# Altium project P22296-1.PrjPcb (part 1 of 3)
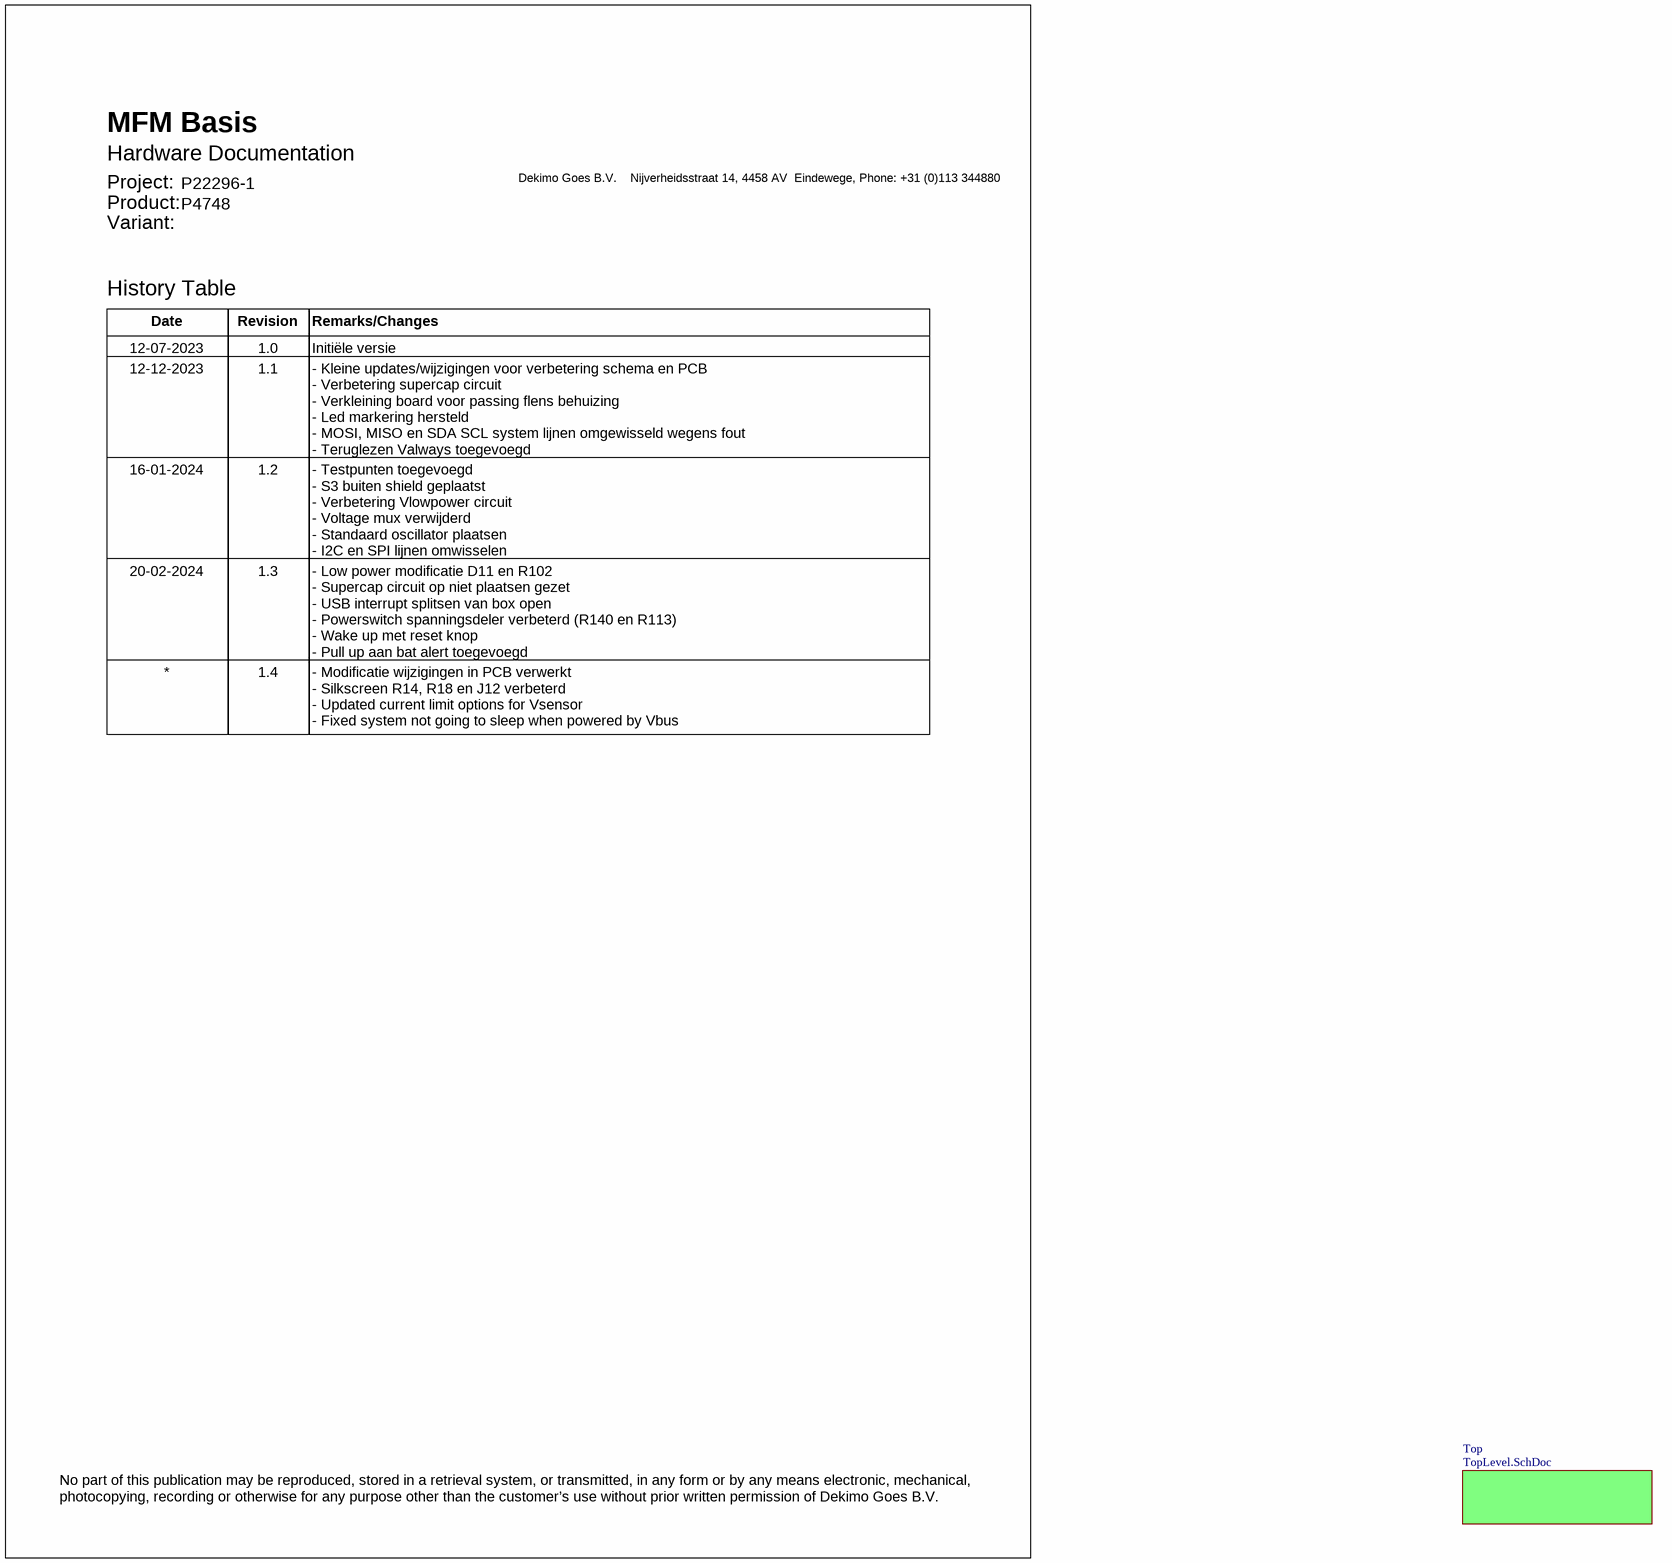
[diagram p0: Revison Table.SchDoc]
DCISheetTotal: 13; Designer: HMK; Drawingnumber: P22296-1-DES-1; PCBRev: 1.2; ProductNumber: P4748; Project: MFM Basis; ProjectNumber: P22296; ProjectRev: 1.4; VolgNumber: 1
14 sheets, 449 parts. Net scope: hierarchical (ports join the sheet entries above them; power ports are global).
Board file: P22296-1-DES-1.2.PcbDoc
Sheets:
  Revison Table.SchDoc
    Top = TopLevel.SchDoc
      U_MCU = MCU.SchDoc
        MCU_RF = MCU_RF.SchDoc
      U_Sensor = Sensor.SchDoc
        SensorSlot1 = SensorSlot1.SchDoc
        SensorSlot2 = SensorSlot2.SchDoc
      U_BatteryMonitor = BatteryMonitor.SchDoc
      U_Mechanical = Mechanical.SchDoc
      U_Memory = Memory.SchDoc
      U_RTC = RTC.SchDoc
      U_USB = USB.SchDoc
      U_Power1 = Power1.SchDoc
      U_Power2 = Power2.SchDoc

## Sheet Revison Table.SchDoc: Titel
size A4 portrait; ApprovedBy: name; CompanyName: DCI Electronics bv; DrawnBy: KRS; Address1: Nijverheidsstraat 14; Address2: 4458 AV Eindewege; Address3: Phone: +31 (0)113 344880; DocumentNumber: 1; Revision: 1; SheetNumber: 1; SheetTotal: 14; PageSetup: Record=PageOptions|CenterHorizontal=True|CenterVertical=True|PrintScale=1.00|XCorrection=1.00|YCorrection=1.00|PrintKind=1|BorderSize=5000000|LeftOffset=0|BottomOffset=0|Orientation=2|PaperLength=1000|PaperWidth=1000|Scale=100|PaperSource=7|PrintQuality=-4|MediaType=1|DitherType=10|PaperKind=ISO_A4_(210.00_x_297.00_MM)|PrintScaleMode=1; SubTitle: SubTitel; ApprovedDate: 01-01-12; DesignedBy: HMK

### Sub-sheets
Top = TopLevel.SchDoc: no entries

### Notes on the sheet
- 12-07-2023
- 1.0
- Initiële versie
- 12-12-2023
- 1.1
- - Kleine updates/wijzigingen voor verbetering schema en PCB
  - Verbetering supercap circuit
  - Verkleining board voor passing flens behuizing
  - Led markering hersteld
  - MOSI, MISO en SDA SCL system lijnen omgewisseld wegens fout
  - Teruglezen Valways toegevoegd
- 16-01-2024
- 1.2
- - Testpunten toegevoegd
  - S3 buiten shield geplaatst
  - Verbetering Vlowpower circuit
  - Voltage mux verwijderd
  - Standaard oscillator plaatsen
  - I2C en SPI lijnen omwisselen
- 20-02-2024
- 1.3
- - Low power modificatie D11 en R102
  - Supercap circuit op niet plaatsen gezet
  - USB interrupt splitsen van box open
  - Powerswitch spanningsdeler verbeterd (R140 en R113)
  - Wake up met reset knop
  - Pull up aan bat alert toegevoegd
- 1.4
- - Modificatie wijzigingen in PCB verwerkt
  - Silkscreen R14, R18 en J12 verbeterd
  - Updated current limit options for Vsensor
  - Fixed system not going to sleep when powered by Vbus
- Hardware Documentation
- Project:
- Product:
- Variant:
- Dekimo Goes B.V.
- Nijverheidsstraat 14, 4458 AV  Eindewege, Phone: +31 (0)113 344880
- History Table
- Date
- Revision
- Remarks/Changes
- No part of this publication may be reproduced, stored in a retrieval system, or transmitted, in any form or by any means electronic, mechanical, photocopying, recording or otherwise for any purpose other than the customer’s use without prior written permission of Dekimo Goes B.V.

## Sheet TopLevel.SchDoc: Titel
size A3; ApprovedBy: name; CompanyName: DCI Electronics bv; DrawnBy: KRS; Address1: Nijverheidsstraat 14; Address2: 4458 AV Eindewege; Address3: Phone: +31 (0)113 344880; DocumentNumber: 2; Revision: 1; SheetNumber: 2; SheetTotal: 14; PageSetup: Record=PageOptions|CenterHorizontal=True|CenterVertical=True|PrintScale=1.00|XCorrection=1.00|YCorrection=1.00|PrintKind=1|BorderSize=5000000|LeftOffset=0|BottomOffset=0|Orientation=2|PaperLength=1000|PaperWidth=1000|Scale=100|PaperSource=7|PrintQuality=-4|MediaType=1|DitherType=10|PaperKind=ISO_A4_(210.00_x_297.00_MM)|PrintScaleMode=1; SubTitle: SubTitel; ApprovedDate: 01-01-12; DesignedBy: HMK
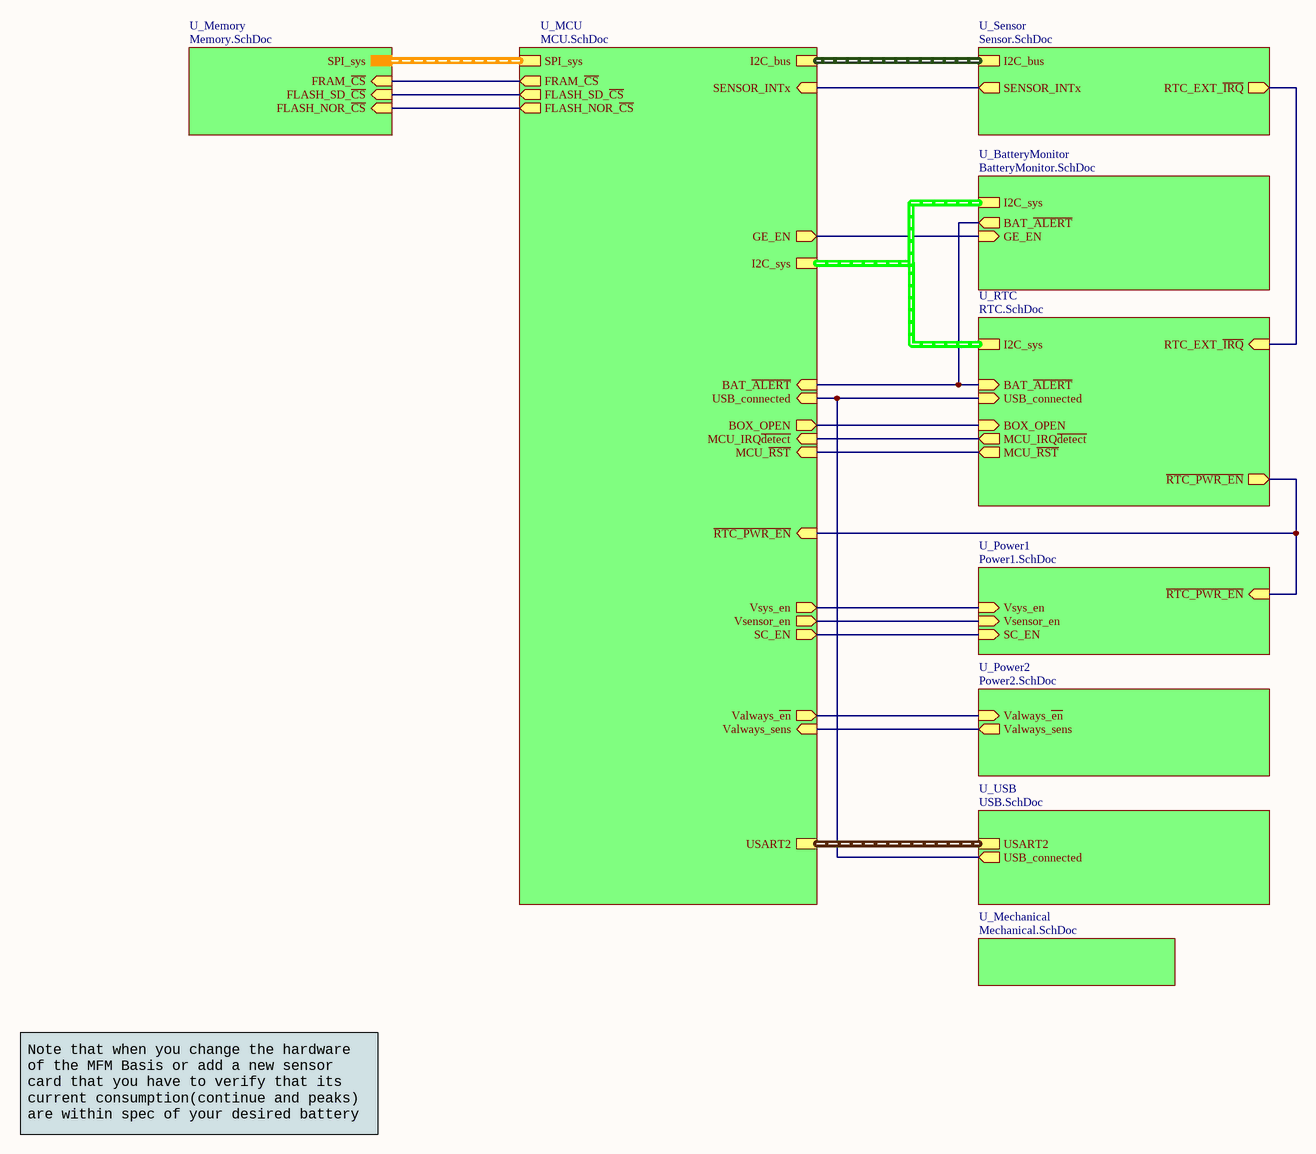
[diagram p1: TopLevel.SchDoc]

### Sub-sheets
U_BatteryMonitor = BatteryMonitor.SchDoc: BAT_~{ALERT} (out), I2C_sys (harness I2C), GE_EN (in)
U_MCU = MCU.SchDoc: MCU_~{RST} (in), SPI_sys (harness SPI), I2C_sys (harness I2C), I2C_bus (harness I2C), USART2 (harness UART), Vsensor_en (out), Vsys_en (out), FRAM_~{CS} (out), FLASH_SD_~{CS} (out), FLASH_NOR_~{CS} (out), MCU_IRQ~{detect} (in), USB_connected (in), SENSOR_INTx (in), Valways_~{en} (out), BAT_~{ALERT} (in), ~{RTC_PWR_EN} (in), SC_EN (out), GE_EN (out), Valways_sens (in), BOX_OPEN (out)
U_Mechanical = Mechanical.SchDoc: no entries
U_Memory = Memory.SchDoc: SPI_sys (harness SPI), FRAM_~{CS} (in), FLASH_SD_~{CS} (in), FLASH_NOR_~{CS} (in)
U_Power1 = Power1.SchDoc: Vsys_en (in), Vsensor_en (in), ~{RTC_PWR_EN} (in), SC_EN (in)
U_Power2 = Power2.SchDoc: Valways_~{en} (in), Valways_sens (out)
U_RTC = RTC.SchDoc: I2C_sys (harness I2C), ~{RTC_PWR_EN} (out), MCU_~{RST} (out), MCU_IRQ~{detect} (out), USB_connected (in), BAT_~{ALERT} (in), BOX_OPEN (in), RTC_EXT_~{IRQ} (in)
U_Sensor = Sensor.SchDoc: I2C_bus (harness I2C), RTC_EXT_~{IRQ} (out), SENSOR_INTx (out)
U_USB = USB.SchDoc: USB_connected (out), USART2 (harness UART)

### Nets
~{RTC_PWR_EN}: sheet U_MCU/~{RTC_PWR_EN}, sheet U_RTC/~{RTC_PWR_EN}, sheet U_Power1/~{RTC_PWR_EN}
BAT_~{ALERT}: sheet U_MCU/BAT_~{ALERT}, sheet U_BatteryMonitor/BAT_~{ALERT}, sheet U_RTC/BAT_~{ALERT}
BOX_OPEN: sheet U_MCU/BOX_OPEN, sheet U_RTC/BOX_OPEN
FLASH_NOR_~{CS}: sheet U_MCU/FLASH_NOR_~{CS}, sheet U_Memory/FLASH_NOR_~{CS}
FLASH_SD_~{CS}: sheet U_MCU/FLASH_SD_~{CS}, sheet U_Memory/FLASH_SD_~{CS}
FRAM_~{CS}: sheet U_MCU/FRAM_~{CS}, sheet U_Memory/FRAM_~{CS}
GE_EN: sheet U_MCU/GE_EN, sheet U_BatteryMonitor/GE_EN
MCU_IRQ~{detect}: sheet U_MCU/MCU_IRQ~{detect}, sheet U_RTC/MCU_IRQ~{detect}
MCU_~{RST}: sheet U_MCU/MCU_~{RST}, sheet U_RTC/MCU_~{RST}
RTC_EXT_~{IRQ}: sheet U_Sensor/RTC_EXT_~{IRQ}, sheet U_RTC/RTC_EXT_~{IRQ}
SC_EN: sheet U_MCU/SC_EN, sheet U_Power1/SC_EN
SENSOR_INTx: sheet U_MCU/SENSOR_INTx, sheet U_Sensor/SENSOR_INTx
USB_connected: sheet U_MCU/USB_connected, sheet U_RTC/USB_connected, sheet U_USB/USB_connected
Valways_~{en}: sheet U_MCU/Valways_~{en}, sheet U_Power2/Valways_~{en}
Valways_sens: sheet U_MCU/Valways_sens, sheet U_Power2/Valways_sens
Vsensor_en: sheet U_MCU/Vsensor_en, sheet U_Power1/Vsensor_en
Vsys_en: sheet U_MCU/Vsys_en, sheet U_Power1/Vsys_en

### Buses and harness runs
harness sheet U_BatteryMonitor/I2C_sys = sheet U_MCU/I2C_sys = sheet U_RTC/I2C_sys
harness sheet U_MCU/I2C_bus = sheet U_Sensor/I2C_bus
harness sheet U_MCU/SPI_sys = sheet U_Memory/SPI_sys
harness sheet U_MCU/USART2 = sheet U_USB/USART2

### Notes on the sheet
- Note that when you change the hardware of the MFM Basis or add a new sensor card that you have to verify that its current consumption(continue and peaks) are within spec of your desired battery
- Designed by:
- Drawing number:
- Variant:
- Date:
- Page:
- Rev:
- Of:
- Dekimo Goes B.V.
- Nijverheidsstraat 14, 4458 AV  Eindewege, Phone: +31 (0)113 344880

## Sheet MCU.SchDoc: Titel
size A3; ApprovedBy: name; CompanyName: DCI Electronics bv; DrawnBy: KRS; Address1: Nijverheidsstraat 14; Address2: 4458 AV Eindewege; Address3: Phone: +31 (0)113 344880; DocumentNumber: 4; Revision: 2; SheetNumber: 4; SheetTotal: 14; PageSetup: Record=PageOptions|CenterHorizontal=True|CenterVertical=True|PrintScale=1.00|XCorrection=1.00|YCorrection=1.00|PrintKind=1|BorderSize=5000000|LeftOffset=0|BottomOffset=0|Orientation=2|PaperLength=1000|PaperWidth=1000|Scale=100|PaperSource=7|PrintQuality=-4|MediaType=1|DitherType=10|PaperKind=ISO_A4_(210.00_x_297.00_MM)|PrintScaleMode=1; SubTitle: SubTitel; ApprovedDate: 01-01-12; DesignedBy: HMK
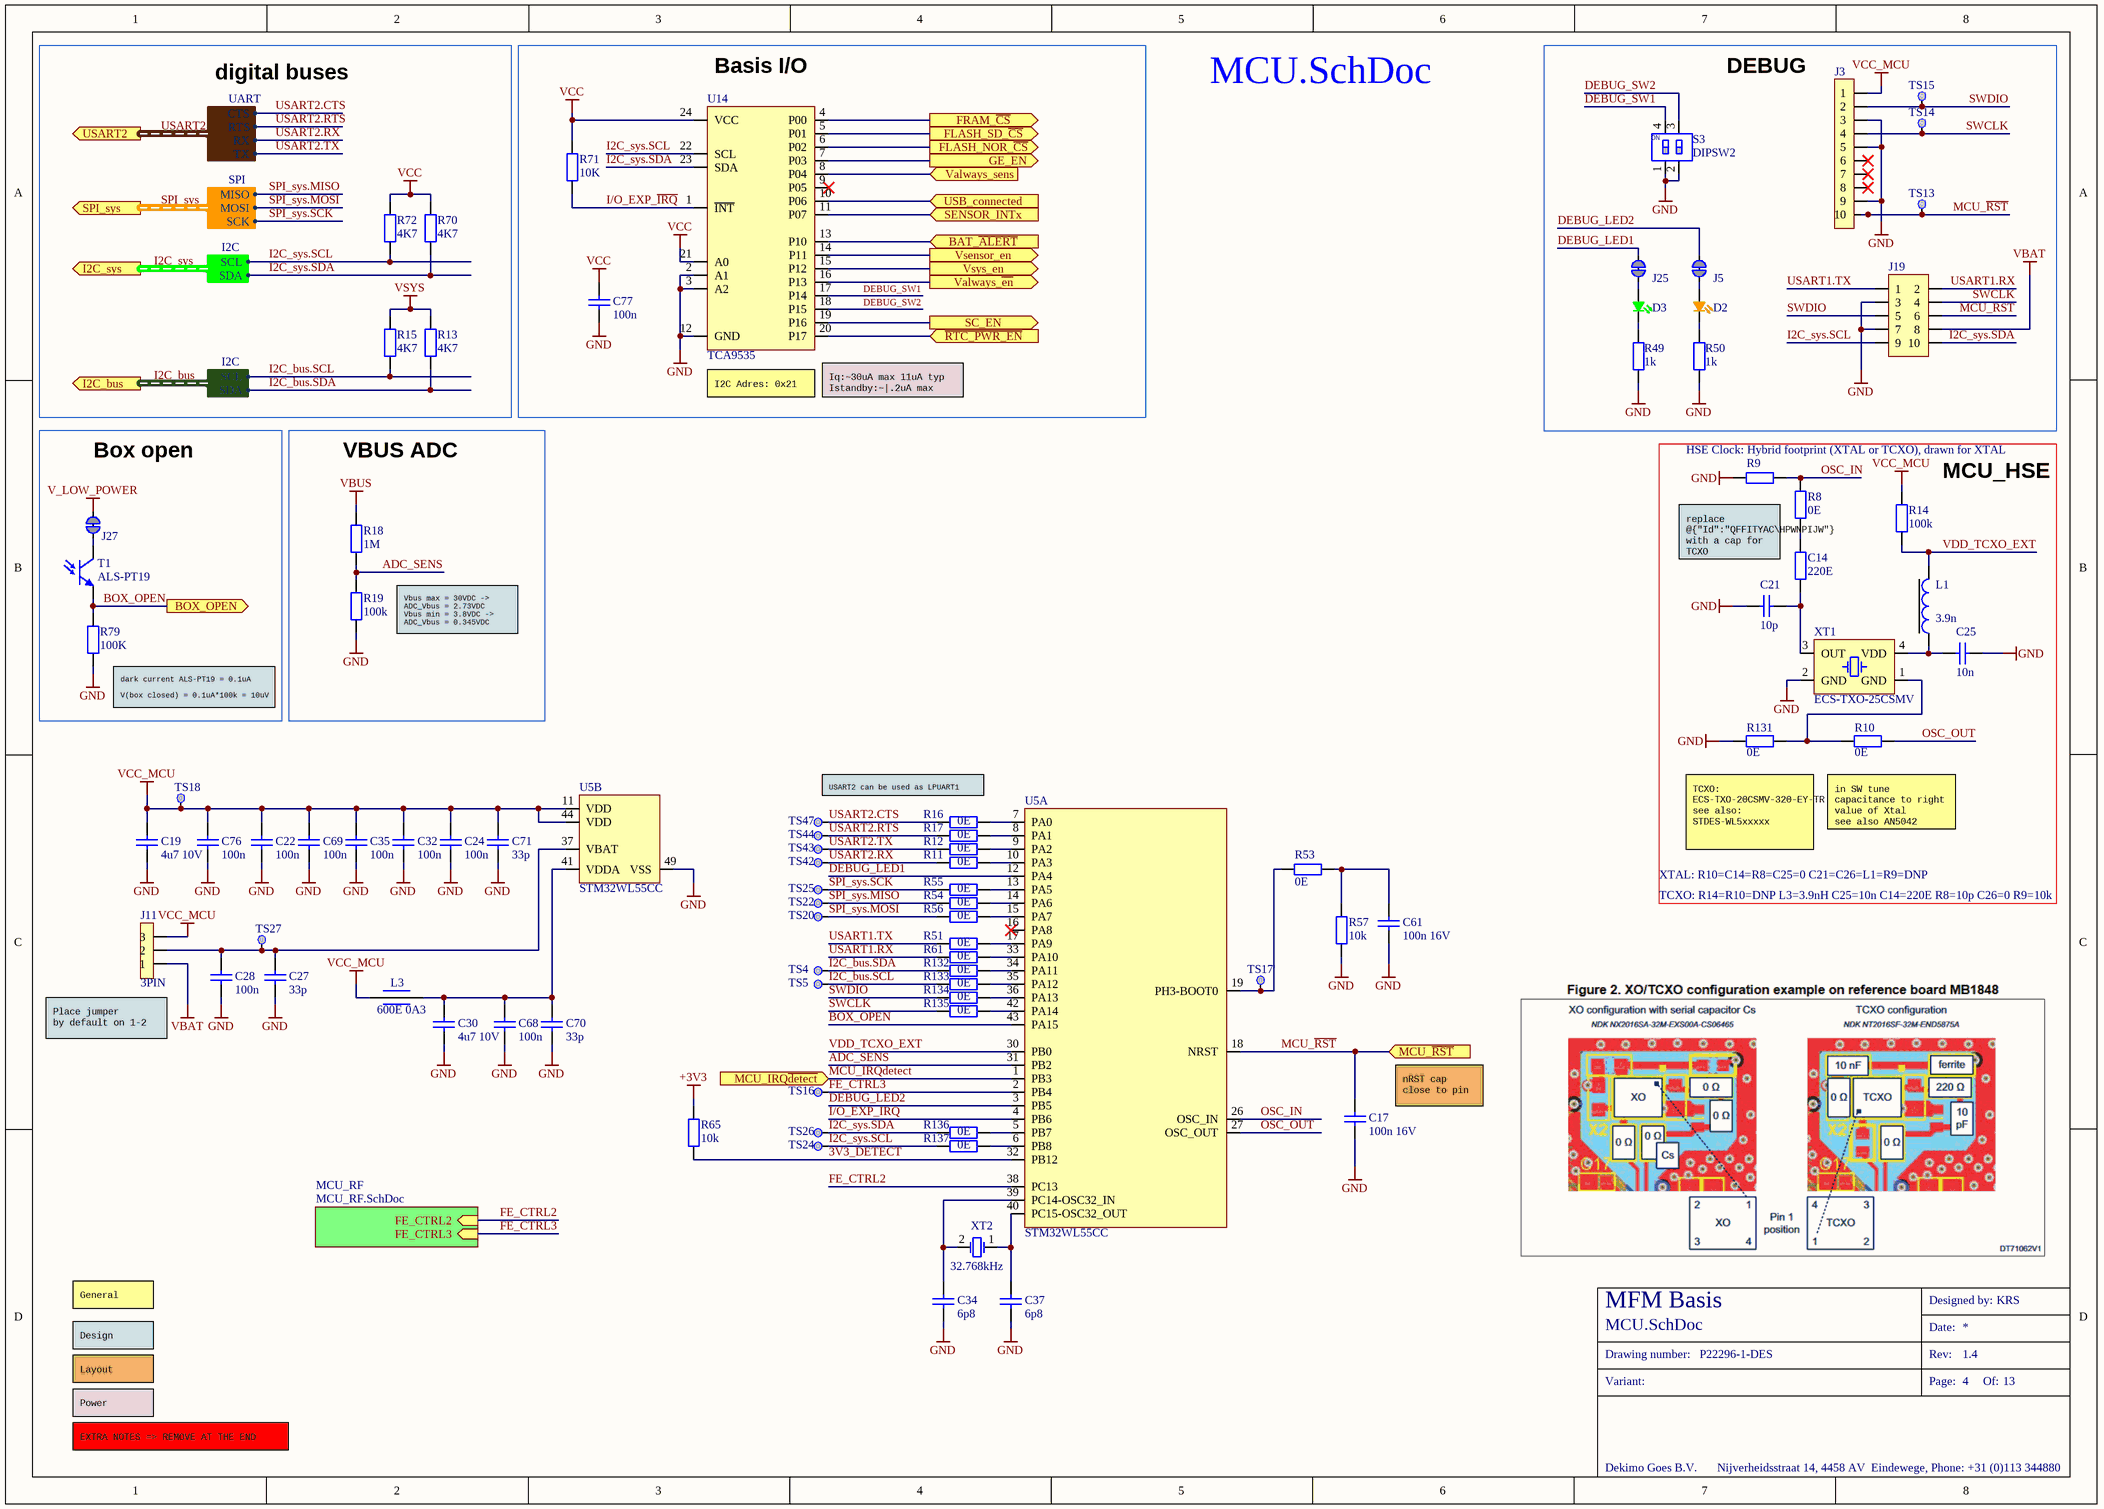
[diagram p2: MCU.SchDoc]

### Parts
C14  220E  [RESC1005X04N]
C17  100n 16V  [CAPC1005X05N]
C19  4u7 10V  [CAPC1608X09N]
C21  10p  [CAPC1005X05N]
C22  100n  [CAPC1005X05N]
C24  100n  [CAP-000G001-002]
C25  10n  [CAP-000G001-002]
C27  33p  [CAP-000G001-002]
C28  100n  [CAP-000G001-002]
C30  4u7 10V  [CAPC1608X09N]
C32  100n  [CAPC1005X05N]
C34  6p8  [CAPC1608X09N]
C35  100n  [CAPC1005X05N]
C37  6p8  [CAPC1608X09N]
C61  100n 16V  [CAPC1005X05N]
C68  100n  [CAPC1005X05N]
C69  100n  [CAPC1005X05N]
C70  33p  [CAP-000G001-002]
C71  33p  [CAPC1005X05N]
C76  100n  [CAPC1005X05N]
C77  100n  [CAPC1608X09N]
D2  (no value)  [LED_0603]
D3  (no value)  [LED_0603_ANODE]
J3  Harwin Archer M50 Series  [PHDR2X5_SMD_P1.27]  (value not drawn)
J5  (no value)  [Solderbridge NC]  (net tie, no BOM)
J11  3PIN  [CON-003G001-003]
J19  (no value)  [PHDR2X5_P2.54]
J25  (no value)  [Solderbridge NC]  (net tie, no BOM)
J27  (no value)  [Solderbridge NC]  (net tie, no BOM)
L1  3.9n  [IND-002G000-002]
L3  600E 0A3  [INDC1608X10N]
R8  0E  [RESC1005X04N]
R9  100E  [RESC1005X04N]  (value not drawn)
R10  0E  [RESC1005X04N]
R11  0E  [RESC1005X04N]
R12  0E  [RESC1005X04N]
R13  4K7  [RESC1005x04N]
R14  100k  [RESC1005X04N]
R15  4K7  [RESC1005x04N]
R16  0E  [RESC1005X04N]
R17  0E  [RESC1005X04N]
R18  1M  [RESC1005x04N]
R19  100k  [RESC1005X04N]
R49  1k  [RESC1608X13N]
R50  1k  [RESC1608X13N]
R51  0E  [RESC1005X04N]
R53  0E  [RESC1005X04N]
R54  0E  [RESC1005X04N]
R55  0E  [RESC1005X04N]
R56  0E  [RESC1005X04N]
R57  10k  [RESC1005X04N]
R61  0E  [RESC1005X04N]
R65  10k  [RESC1005X04N]
R70  4K7  [RESC1005x04N]
R71  10K  [RESC1608X13N]
R72  4K7  [RESC1005x04N]
R79  100K  [RESC1608X13N]
R131  0E  [RESC1005X04N]
R132  0E  [RESC1005X04N]
R133  0E  [RESC1005X04N]
R134  0E  [RESC1005X04N]
R135  0E  [RESC1005X04N]
R136  0E  [RESC1005X04N]
R137  0E  [RESC1005X04N]
S3  DIPSW2  [SW_GDH02S04]
T1  ALS-PT19  [SMD-000G001-002]
TS4  TESTPAD  [TESTPAD 2MM]  (value not drawn)  (no BOM)
TS5  TESTPAD  [TESTPAD 2MM]  (value not drawn)  (no BOM)
TS13  TESTPAD  [TESTPAD 2MM]  (value not drawn)  (no BOM)
TS14  TESTPAD  [TESTPAD 2MM]  (value not drawn)  (no BOM)
TS15  TESTPAD  [TESTPAD 2MM]  (value not drawn)  (no BOM)
TS16  TESTPAD  [TESTPAD 2MM]  (value not drawn)  (no BOM)
TS17  TESTPAD  [TESTPAD 2MM]  (value not drawn)  (no BOM)
TS18  TESTPAD  [TESTPAD 2MM]  (value not drawn)  (no BOM)
TS20  TESTPAD  [TESTPAD 2MM]  (value not drawn)  (no BOM)
TS22  TESTPAD  [TESTPAD 2MM]  (value not drawn)  (no BOM)
TS24  TESTPAD  [TESTPAD 2MM]  (value not drawn)  (no BOM)
TS25  TESTPAD  [TESTPAD 2MM]  (value not drawn)  (no BOM)
TS26  TESTPAD  [TESTPAD 2MM]  (value not drawn)  (no BOM)
TS27  TESTPAD  [TESTPAD 2MM]  (value not drawn)  (no BOM)
TS42  TESTPAD  [TESTPAD 2MM]  (value not drawn)  (no BOM)
TS43  TESTPAD  [TESTPAD 2MM]  (value not drawn)  (no BOM)
TS44  TESTPAD  [TESTPAD 2MM]  (value not drawn)  (no BOM)
TS47  TESTPAD  [TESTPAD 2MM]  (value not drawn)  (no BOM)
U5  STM32WL55CC  [QFN-500G000-048]  (parts A,B of 4)
U14  TCA9535  [SOP-650001-024]
XT1  ECS-TXO-25CSMV  [XTL-001G001-004]
XT2  32.768kHz  [CHIP2PINSM127P600-8N]

### Blocks framed on the sheet
digital buses: R13 R15 R70 R72
Basis I/O: C77 R71 U14
DEBUG: D2 D3 J3 J5 J19 J25 R49 R50 S3 TS13-TS15
Box open: J27 R79 T1
VBUS ADC: R18 R19
MCU_HSE: C14 C21 C25 L1 R8-R10 R14 R131 XT1

### Sub-sheets
MCU_RF = MCU_RF.SchDoc: FE_CTRL2 (in), FE_CTRL3 (in)

### Ports
BAT_~{ALERT} (in), BOX_OPEN (out), FLASH_NOR_~{CS} (out), FLASH_SD_~{CS} (out), FRAM_~{CS} (out), GE_EN (out), I2C_bus (out, harness I2C), I2C_sys (out, harness I2C), MCU_IRQ~{detect} (in), MCU_~{RST} (in), SC_EN (out), SENSOR_INTx (in), SPI_sys (out, harness SPI), USART2 (out, harness UART), USB_connected (in), Valways_sens (in), Valways_~{en} (out), Vsensor_en (out), Vsys_en (out), ~{RTC_PWR_EN} (in)

### Harnesses
SPI: MISO, MOSI, SCK
I2C: SCL, SDA
UART: CTS, RTS, RX, TX

### Nets
+3V3: R65.2
GND: C17.1 C19.1 C21.1 C22.1 C24.1 C25.1 C27.1 C28.1 C30.1 C32.1 C34.1 C35.1 C37.1 C61.1 C68.1 C69.1 C70.1 C71.1 C76.1 C77.1 J3.3 J3.5 J3.9 J19.3 J19.7 R9.1 R19.1 R49.1 R50.1 R57.1 R79.1 R131.1 S3.1(A1) S3.2(A2) U5.49(VSS) U14.2(A1) U14.3(A2) U14.12(GND) XT1.2(GND)
V_LOW_POWER: J27.2
VBAT: J11.1 J19.8
VBUS: R18.1
VCC: C77.2 R70.2 R71.2 R72.2 U14.21(A0) U14.24(VCC)
VCC_MCU: C19.2 C22.2 C24.2 C32.2 C35.2 C69.2 C71.2 C76.2 J3.1 J11.3 L3.1 R14.2 TS18.1(TP) U5.11(VDD) U5.44(VDD)
VSYS: R13.2 R15.2
3V3_DETECT: R65.1 U5.32(PB12)  [project net 3V3_DETECT_4]
~{RTC_PWR_EN}: U14.20(P17) ; port ~{RTC_PWR_EN}
ADC_SENS: R18.2 R19.2 U5.31(PB2)  [project net ADC_SENS_4]
BAT_~{ALERT}: U14.13(P10) ; port BAT_~{ALERT}
BOX_OPEN: R79.2 T1.2 U5.43(PA15) ; port BOX_OPEN
DEBUG_LED1: J25.2 U5.12(PA4)  [project net DEBUG_LED1_4]
DEBUG_LED2: J5.2 U5.3(PB5)  [project net DEBUG_LED2_4]
DEBUG_SW1: S3.4(B1) U14.17(P14)  [project net DEBUG_SW1_4]
DEBUG_SW2: S3.3(B2) U14.18(P15)  [project net DEBUG_SW2_4]
FE_CTRL2: U5.38(PC13) ; sheet MCU_RF/FE_CTRL2
FE_CTRL3: TS16.1(TP) U5.2(PB4) ; sheet MCU_RF/FE_CTRL3
FLASH_NOR_~{CS}: U14.6(P02) ; port FLASH_NOR_~{CS}
FLASH_SD_~{CS}: U14.5(P01) ; port FLASH_SD_~{CS}
FRAM_~{CS}: U14.4(P00) ; port FRAM_~{CS}
GE_EN: U14.7(P03) ; port GE_EN
I2C_bus.SCL: R15.1 R133.1 TS5.1(TP) ; port I2C_bus.SCL
I2C_bus.SDA: R13.1 R132.1 TS4.1(TP) ; port I2C_bus.SDA
I2C_sys.SCL: J19.9 R72.1 R137.1 TS24.1(TP) U14.22(SCL) ; port I2C_sys.SCL
I2C_sys.SDA: J19.10 R70.1 R136.1 TS26.1(TP) U14.23(SDA) ; port I2C_sys.SDA
I/O_EXP_~{IRQ}: R71.1 U5.4(PB6) U14.1(~{INT})  [project net I/O_EXP_~{IRQ}_4]
MCU_IRQ~{detect}: U5.1(PB3) ; port MCU_IRQ~{detect}
MCU_~{RST}: C17.2 J3.10 J19.6 TS13.1(TP) U5.18(NRST) ; port MCU_~{RST}
OSC_IN: R8.2 R9.2 U5.26(OSC_IN)  [project net OSC_IN_4]
OSC_OUT: R10.2 U5.27(OSC_OUT)  [project net OSC_OUT_4]
SC_EN: U14.19(P16) ; port SC_EN
SENSOR_INTx: U14.11(P07) ; port SENSOR_INTx
SPI_sys.MISO: R54.1 TS22.1(TP) ; port SPI_sys.MISO
SPI_sys.MOSI: R56.1 TS20.1(TP) ; port SPI_sys.MOSI
SPI_sys.SCK: R55.1 TS25.1(TP) ; port SPI_sys.SCK
SWCLK: J3.4 J19.4 R135.1 TS14.1(TP)  [project net SWCLK_4]
SWDIO: J3.2 J19.5 R134.1 TS15.1(TP)  [project net SWDIO_4]
USART1.RX: J19.2 R61.1  [project net USART1.RX_4]
USART1.TX: J19.1 R51.1  [project net USART1.TX_4]
USART2.CTS: R16.1 TS47.1(TP) ; port USART2.CTS
USART2.RTS: R17.1 TS44.1(TP) ; port USART2.RTS
USART2.RX: R11.1 TS42.1(TP) ; port USART2.RX
USART2.TX: R12.1 TS43.1(TP) ; port USART2.TX
USB_connected: U14.10(P06) ; port USB_connected
Valways_~{en}: U14.16(P13) ; port Valways_~{en}
Valways_sens: U14.8(P04) ; port Valways_sens
VDD_TCXO_EXT: L1.2 R14.1 U5.30(PB0)  [project net VDD_TCXO_EXT_4]
Vsensor_en: U14.14(P11) ; port Vsensor_en
Vsys_en: U14.15(P12) ; port Vsys_en
NetC14_1: C14.1 C21.2 XT1.3(OUT)
NetC14_2: C14.2 R8.1
NetC25_2: C25.2 L1.1 XT1.4(VDD)
NetC27_2: C27.2 C28.2 J11.2 TS27.1(TP) U5.37(VBAT)
NetC30_2: C30.2 C68.2 C70.2 L3.2 U5.41(VDDA)
NetC34_2: C34.2 U5.39(PC14-OSC32_IN) XT2.2(OSC2)
NetC37_2: C37.2 U5.40(PC15-OSC32_OUT) XT2.1(OSC1)
NetC61_2: C61.2 R53.1 R57.2
NetD2_A: D2.A J5.1
NetD2_C: D2.C R50.2
NetD3_A: D3.A J25.1
NetD3_C: D3.C R49.2
NetJ27_1: J27.1 T1.1
NetR10_1: R10.1 R131.2 XT1.1(GND)
NetR11_2: R11.2 U5.10(PA3)
NetR12_2: R12.2 U5.9(PA2)
NetR16_2: R16.2 U5.7(PA0)
NetR17_2: R17.2 U5.8(PA1)
NetR51_2: R51.2 U5.17(PA9)
NetR53_2: R53.2 TS17.1(TP) U5.19(PH3-BOOT0)
NetR54_2: R54.2 U5.14(PA6)
NetR55_2: R55.2 U5.13(PA5)
NetR56_2: R56.2 U5.15(PA7)
NetR61_2: R61.2 U5.33(PA10)
NetR132_2: R132.2 U5.34(PA11)
NetR133_2: R133.2 U5.35(PA12)
NetR134_2: R134.2 U5.36(PA13)
NetR135_2: R135.2 U5.42(PA14)
NetR136_2: R136.2 U5.5(PB7)
NetR137_2: R137.2 U5.6(PB8)

Not connected (* = marked no-connect by the designer): J3 6* 7* 8*; U5 16(PA8)*; U14 9(P05)*

### Buses and harness runs
harness I2C_bus = port I2C_bus
harness I2C_sys = port I2C_sys
harness SPI_sys = port SPI_sys
harness USART2 = port USART2

### Notes on the sheet
- (near U14) I2C Adres: 0x21
- (near U14) Iq:~30uA max 11uA typ
  Istandby:~2.2uA max
- HSE Clock: Hybrid footprint (XTAL or TCXO), drawn for XTAL
- replace @{"Id":"QFFITYAC\HPWNPIJW"}  with a cap for TCXO
- Vbus max = 30VDC -> ADC_Vbus = 2.73VDC
  Vbus min = 3.8VDC ->
  ADC_Vbus = 0.345VDC
- (near R79) dark current ALS-PT19 = 0.1uA
  V(box closed) = 0.1uA*100k = 10uV
- USART2 can be used as LPUART1
- TCXO: ECS-TXO-20CSMV-320-EY-TR
  see also: STDES-WL5xxxxx
- (near R10) in SW tune capacitance to right value of Xtal
  see also AN5042
- TCXO: R14=R10=DNP L3=3.9nH C25=10n C14=220E R8=10p C26=0 R9=10k
- XTAL: R10=C14=R8=C25=0 C21=C26=L1=R9=DNP
- (near J11) Place jumper
  by default on 1-2
- (near C17) nRST cap close to pin
- General
- Design
- Layout
- Power
- EXTRA NOTES => REMOVE AT THE END
- Designed by:
- Drawing number:
- Variant:
- Date:
- Page:
- Rev:
- Of:
- Dekimo Goes B.V.
- Nijverheidsstraat 14, 4458 AV  Eindewege, Phone: +31 (0)113 344880
- (in symbol SW DIP2SO/G2) ON

### Library data of the parts
C14 = R 220E/70: 220ohm 62.5mW 1%; EngPartGrpMainCode: RES; ManufactpartCode: MCWR04X2200FTL-MUP; Type: Resistor metalfilm SMD; Preferred: False; SMD_Flag: True; PartCode: R 220E/70
C17 C22 C32 C35 C61 C68 C69 C76 = CKE 100N/70: 100nF, 16V, 10%, X7R; EngPartGrpMainCode: CAP; ManufactpartCode: CC0402KRX7R7BB104-YAG; Type: Capacitor ceramic SMD; Preferred: False; SMD_Flag: True; PartCode: CKE 100N/70
C19 C30 = CKE 4U7V10/60: 4.7uF 10% 10V X5R; EngPartGrpMainCode: CAP; ManufactpartCode: 0603ZD475KAT2A-AVX; Type: Capacitor ceramic SMD; Preferred: False; SMD_Flag: True; PartCode: CKE 4U7V10/60
C21 = CKE 10P/70: 10pF, 50V, 5%, NP0; EngPartGrpMainCode: CAP; ManufactpartCode: CC0402JRNPO9BN100-YAG; Type: Capacitor ceramic SMD; Preferred: False; SMD_Flag: True; PartCode: CKE 10P/70
C24 C28 = CKE 100N/91: 100nF, 10V, X5R; EngPartGrpMainCode: CAP; ManufactpartCode: GRM033R61A104KE15D-MUR; Type: Capacitor ceramic SMD; Preferred: False; SMD_Flag: True; PartCode: CKE 100N/91
C25 = CKE 10N/90: 10nF, 10V, X7R; EngPartGrpMainCode: CAP; ManufactpartCode: C0603X7R1A103K030BA-TDK; Type: Capacitor ceramic SMD; Preferred: False; SMD_Flag: True; PartCode: CKE 10N/90
C27 C70 = CKE 33P/90: 33pF, 25V, 5%; EngPartGrpMainCode: CAP; ManufactpartCode: GJM0335C1E330JB01D-MUR; Type: Capacitor ceramic SMD; Preferred: False; SMD_Flag: True; PartCode: CKE 33P/90
C34 C37 = CKE 6P8/60: 6p8 +-0.5p 25V NP0; EngPartGrpMainCode: CAP; ManufactpartCode: GRM1885C1H6R8DA01D-MUR; Type: Capacitor ceramic SMD; Preferred: False; SMD_Flag: True; PartCode: CKE 6P8/60
C71 = CKE 33P/70: 33pF, 50V, 5%, COG; EngPartGrpMainCode: CAP; ManufactpartCode: 223886915339-YAG; Type: Capacitor ceramic SMD; Preferred: False; SMD_Flag: True; PartCode: CKE 33P/70
C77 = CKE 100N/60: 100nF 50V 10% X7R; EngPartGrpMainCode: CAP; ManufactpartCode: 2238 586 15649-PHI; Type: Capacitor ceramic SMD; Preferred: False; SMD_Flag: True; PartCode: CKE 100N/60
D2 = LED SMDO/3: Led Orange 0603; EngPartGrpMainCode: OPTO; ManufactpartCode: 150060AS75000-WE; Type: LED SMD; Preferred: False; SMD_Flag: True; PartCode: LED SMDO/3
D3 = LED SMDG/16: Led Groen 0603; EngPartGrpMainCode: OPTO; ManufactpartCode: 150060VS75003-WE; Type: LED SMD; Preferred: False; SMD_Flag: True; PartCode: LED SMDG/16
J3 = CON PHDR2X5S/10: pinh 2x5/straight/Au/1.27pitch; EngPartGrpMainCode: CONN; ManufactpartCode: M50-3600542-HAR; Preferred: False; SMD_Flag: True; PartCode: CON PHDR2X5S/10; Type: Connector pinhdr SMD
J5 J25 J27 = SolderbridgeNC: Solderbridge  - Normally Connected
J11 = CON PHDR1X3S/11: pinh 1x3/straight/Au/1.27pitch; EngPartGrpMainCode: CONN; ManufactpartCode: M50-3630342-HAR; Preferred: False; SMD_Flag: True; PartCode: CON PHDR1X3S/11; Type: Connector pinhdr SMD
J19 = CON PHDR2X5S/5: pinh 2x5/straight/h=6.7/Au; EngPartGrpMainCode: CONN; ManufactpartCode: 826632-5-TYC; Remark: CON PHDR2X36S/1 Part; Preferred: False; PartCode: CON PHDR2X5S/5; Type: Connector Pinheader; SMD_Flag: False
L1 = IND 3N9/70: 3.9nH 0.1nH 750mA; EngPartGrpMainCode: IND; ManufactpartCode: LQW15AN3N9B00D-MUR; Type: Inductor choke SMD; Preferred: False; SMD_Flag: True; PartCode: IND 3N9/70
L3 = IND 600E 0A3/1: 600E @100Mhz 0.3A; EngPartGrpMainCode: IND; ManufactpartCode: 742792653-WE; Type: Ferrite bead SMD; Preferred: False; SMD_Flag: True; PartCode: IND 600E 0A3/1
R8 R10-R12 R16 R17 R51 R53-R56 R61 R131-R137 = R 0E/70: 0E, 62.5mW, 1%; PartCode: R 0E/70; EngPartGrpMainCode: RES; ManufactpartCode: RC0402JR-070RL-YAG; Preferred: False; SMD_Flag: True; Type: Resistor metalfilm SMD
R9 = R 100E/70: 100E, 62.5mW, 1%; EngPartGrpMainCode: RES; ManufactpartCode: RC0402FR-07100RL-YAG; Preferred: False; SMD_Flag: True; PartCode: R 100E/70; Type: Resistor metalfilm SMD
R13 R15 R70 R72 = R 4K7/70: 4K7, 62.5mW, 1%; EngPartGrpMainCode: RES; ManufactpartCode: RC0402FR-074K7L-YAG; Preferred: False; SMD_Flag: True; PartCode: R 4K7/70; Type: Resistor metalfilm SMD
R14 R19 = R 100K/70: 100K, 62.5mW, 1%; EngPartGrpMainCode: RES; ManufactpartCode: RC0402FR-07100KL-YAG; Preferred: False; SMD_Flag: True; PartCode: R 100K/70; Type: Resistor metalfilm SMD
R18 = R 1M/70: 1M, 62.5mW, 1%; PartCode: R 1M/70; EngPartGrpMainCode: RES; ManufactpartCode: RC0402FR-071ML-YAG; Preferred: False; SMD_Flag: True; Type: Resistor metalfilm SMD
R49 R50 = R 1K/60: 1K, 100mW, 1%; PartCode: R 1K/60; EngPartGrpMainCode: RES; ManufactpartCode: RC0603FR-071KL-YAG; Preferred: True; Type: Resistor metalfilm SMD; SMD_Flag: True
R57 R65 = R 10K/70: 10K, 62.5mW, 1%; EngPartGrpMainCode: RES; ManufactpartCode: RC0402FR-0710KL-YAG; Preferred: False; SMD_Flag: True; PartCode: R 10K/70; Type: Resistor metalfilm SMD
R71 = R 10K/60: 10k 100mW, 1%; EngPartGrpMainCode: RES; ManufactpartCode: RC0603FR-0710KL-YAG; Preferred: True; PartCode: R 10K/60; Type: Resistor metalfilm SMD; SMD_Flag: True
R79 = R 100K/60: 100k 100mW, 1%; EngPartGrpMainCode: RES; ManufactpartCode: CRG0603F100K-TEC; Preferred: True; PartCode: R 100K/60; Type: Resistor metalfilm SMD; SMD_Flag: True
S3 = SW DIP2SO/G2: DIP,2p,Straight,H=2,3mm,SMD,AU; EngPartGrpMainCode: SWI; ManufactpartCode: GDH02S04-TYC; Preferred: False; SMD_Flag: True; PartCode: SW DIP2SO/G2; Type: Switch slide SMD
T1 = IC ALS-PT19: Ambient Light Sensor; EngPartGrpMainCode: IC; ManufactpartCode: ALS-PT19-315C/L177/TR8-EVE; Remark: Bottom Marking; Type: IC Peripheral SMD; Preferred: False; SMD_Flag: True; PartCode: IC ALS-PT19
TS4 TS5 TS13-TS18 TS20 TS22 TS24-TS27 TS42-TS44 TS47 = TESTPAD-2.0: 0.5mm Testpad SMD; PartCode: TESTPAD-2.0
U5 = IC STM32WL55CC: EngPartGrpMainCode: IC; ManufactpartCode: STM32WL55CCU6-STM; Preferred: False; SMD_Flag: True; PartCode: IC STM32WL55CC; Type: IC microcontroller SMD
U14 = IC TCA9535/SO: 16-bits  I2C I/O Expander; EngPartGrpMainCode: IC; ManufactpartCode: TCA9535PWR-TI; Preferred: False; SMD_Flag: True; PartCode: IC TCA9535/SO; Type: IC Peripheral SMD
XT1 = OSC 32MHZ/2: 32Mhz 1V7-3V465 2x1.6mm; EngPartGrpMainCode: XTAL; ManufactpartCode: ECS-TXO-20CSMV-320-EY-TR-ECS; Preferred: False; SMD_Flag: True; PartCode: OSC 32MHZ/2; Type: Crystal Oscillator SMD
XT2 = XT 32.768KHZ/S2: 32.768kHz 20ppm 12.5pF; ManufactpartCode: FC-135 32.7680KA-A3-EPS; Preferred: False; SMD_Flag: True; PartCode: XT 32.768KHZ/S2; EngPartGrpMainCode: XTAL; Type: Quarz crystal SMD

## Sheet MCU_RF.SchDoc: Titel
size A3; ApprovedBy: name; CompanyName: DCI Electronics bv; DrawnBy: KRS; Address1: Nijverheidsstraat 14; Address2: 4458 AV Eindewege; Address3: Phone: +31 (0)113 344880; DocumentNumber: 5; Revision: 1; SheetNumber: 5; SheetTotal: 14; PageSetup: Record=PageOptions|CenterHorizontal=True|CenterVertical=True|PrintScale=1.00|XCorrection=1.00|YCorrection=1.00|PrintKind=1|BorderSize=5000000|LeftOffset=0|BottomOffset=0|Orientation=2|PaperLength=1000|PaperWidth=1000|Scale=100|PaperSource=7|PrintQuality=-4|MediaType=1|DitherType=10|PaperKind=ISO_A4_(210.00_x_297.00_MM)|PrintScaleMode=1; SubTitle: SubTitel; ApprovedDate: 01-01-12; DesignedBy: KRS
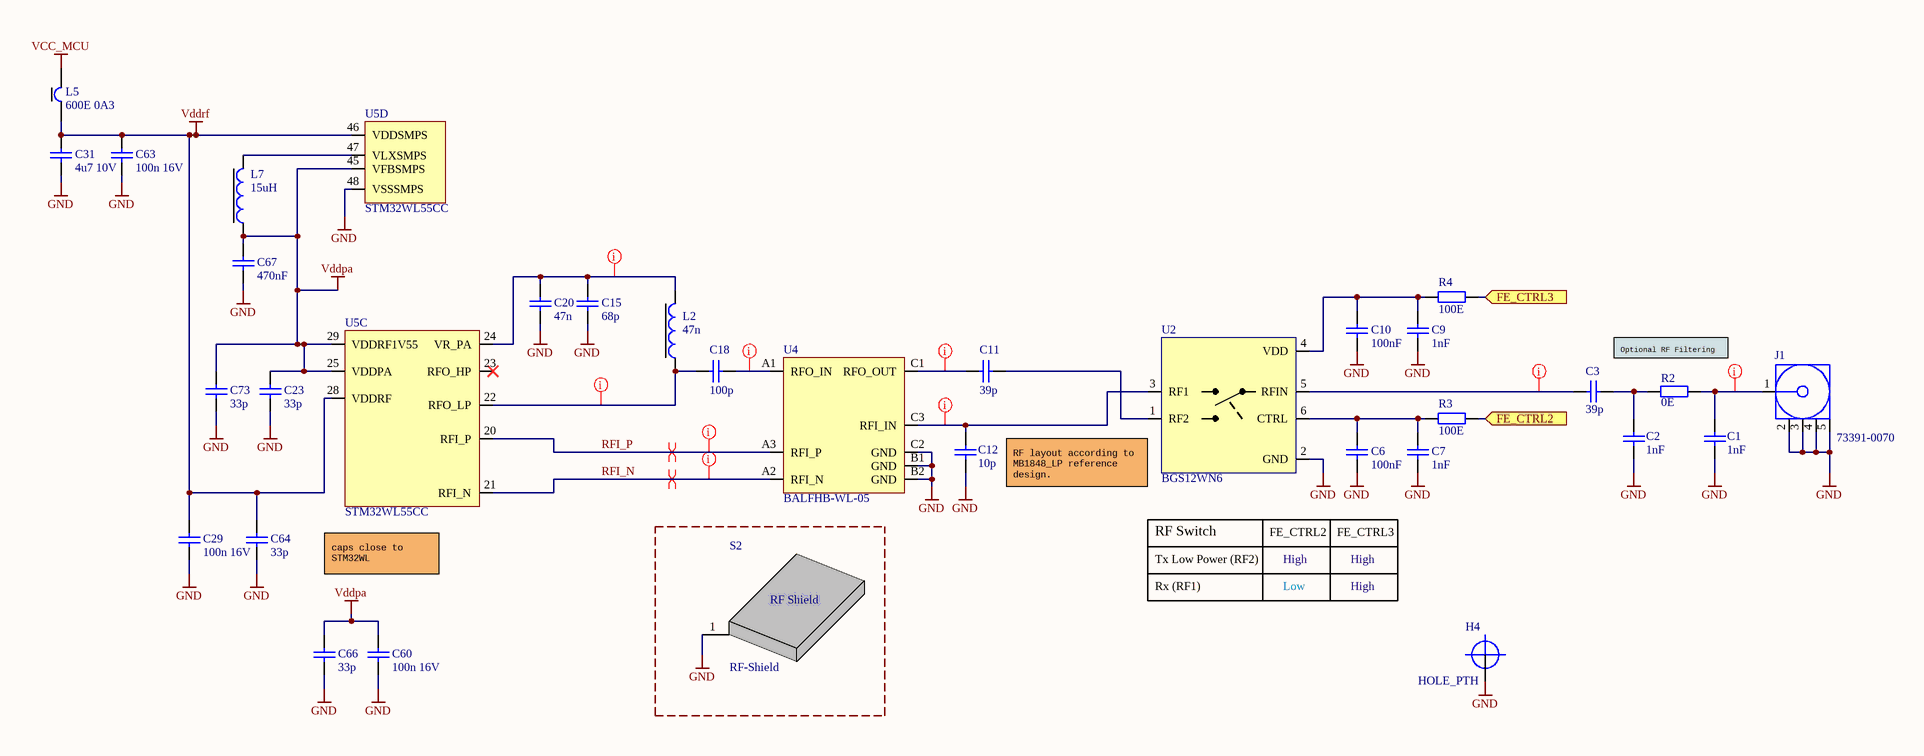
[diagram p3: MCU_RF.SchDoc]

### Parts
C1  1nF  [CAP-000G001-002]
C2  1nF  [CAP-000G001-002]
C3  39p  [CAP-000G001-002]
C6  100nF  [CAP-000G001-002]
C7  1nF  [CAP-000G001-002]
C9  1nF  [CAP-000G001-002]
C10  100nF  [CAP-000G001-002]
C11  39p  [CAP-000G001-002]
C12  10p  [CAP-000G001-002]
C15  68p  [Cap-000G002-002]
C18  100p  [CAP-000G001-002]
C20  47n  [Cap-000G002-002]
C23  33p  [CAP-000G001-002]
C29  100n 16V  [CAPC1005X05N]
C31  4u7 10V  [CAPC1608X09N]
C60  100n 16V  [CAPC1005X05N]
C63  100n 16V  [CAPC1005X05N]
C64  33p  [CAP-000G001-002]
C66  33p  [CAP-000G001-002]
C67  470nF  [CAPC1608X09N]
C73  33p  [CAP-000G001-002]
H4  HOLE_PTH  [PTH_0.8_1.5]  (no BOM)
J1  73391-0070  [AMP-SMA-132134]
L2  47n  [IND-000G002-002]
L5  600E 0A3  [INDC1608X10N]
L7  15uH  [IND-000G004-002]
R2  0E  [RES-000G001-002]
R3  100E  [RES-000G001-002]
R4  100E  [RES-000G001-002]
S2  RF-Shield  [SHLD-000G000]
U2  BGS12WN6  [DFN-400G001-006]
U4  BALFHB-WL-05  [BGA-690G001-008]
U5  STM32WL55CC  [QFN-500G000-048]  (parts C,D of 4)

### Ports
FE_CTRL2 (in), FE_CTRL3 (in)

### Nets
GND: C1.1 C2.1 C6.1 C7.1 C9.1 C10.1 C12.1 C15.1 C20.1 C23.1 C29.1 C31.1 C60.1 C63.1 C64.1 C66.1 C67.1 C73.1 H4.0 J1.2(GND) J1.3(GND) J1.4(GND) J1.5(GND) S2.1 U2.2(GND) U4.B1(GND) U4.B2(GND) U4.C2(GND) U5.48(VSSSMPS)
VCC_MCU: L5.2
Vddpa: C23.2 C60.2 C66.2 C67.2 C73.2 L7.1 U5.25(VDDPA) U5.29(VDDRF1V55) U5.45(VFBSMPS)
Vddrf: C29.2 C31.2 C63.2 C64.2 L5.1 U5.28(VDDRF) U5.46(VDDSMPS)
FE_CTRL2: R3.2 ; port FE_CTRL2
FE_CTRL3: R4.2 ; port FE_CTRL3
RFI_N: U4.A2(RFI_N) U5.21(RFI_N)  [project net RFI_N_5]
RFI_P: U4.A3(RFI_P) U5.20(RFI_P)  [project net RFI_P_5]
NetC1_2: C1.2 J1.1(Signal) R2.1
NetC2_2: C2.2 C3.1 R2.2
NetC3_2: C3.2 U2.5(RFIN)
NetC6_2: C6.2 C7.2 R3.1 U2.6(CTRL)
NetC9_2: C9.2 C10.2 R4.1 U2.4(VDD)
NetC11_1: C11.1 U4.C1(RFO_OUT)
NetC11_2: C11.2 U2.1(RF2)
NetC12_2: C12.2 U2.3(RF1) U4.C3(RFI_IN)
NetC15_2: C15.2 C20.2 L2.2 U5.24(VR_PA)
NetC18_1: C18.1 L2.1 U5.22(RFO_LP)
NetC18_2: C18.2 U4.A1(RFO_IN)
NetL7_2: L7.2 U5.47(VLXSMPS)

Not connected (* = marked no-connect by the designer): U5 23(RFO_HP)*

### Layout directives
differential pair: RFI_N_5, RFI_P_5
net class 50ohm: NetC1_2, NetC3_2, NetC11_1, NetC12_2, NetC15_2, NetC18_1, NetC18_2
net class 100R_diff: RFI_N_5, RFI_P_5

### Notes on the sheet
- Optional RF Filtering
- (near U2) RF layout according to MB1848_LP reference design.
- RF Switch
- FE_CTRL2
- FE_CTRL3
- (near U5) caps close to STM32WL
- Tx Low Power (RF2)
- Rx (RF1)
- Low
- High
- Designed by:
- Drawing number:
- Variant:
- Date:
- Page:
- Rev:
- Of:
- Dekimo Goes B.V.
- Nijverheidsstraat 14, 4458 AV  Eindewege, Phone: +31 (0)113 344880
- (in symbol MEC SHIELD) RF Shield

### Library data of the parts
C1 C2 C7 C9 = CKE 1N/90: 1nF 50V 10% X7R; EngPartGrpMainCode: CAP; ManufactpartCode: GRM033R71H102KA12D-MUR; Type: Capacitor ceramic SMD; Preferred: False; SMD_Flag: True; PartCode: CKE 1N/90
C3 C11 = CKE 39P/90: 39pF, 50V, 10%; EngPartGrpMainCode: CAP; ManufactpartCode: GRM0335C1H390JA01D-MUR; Type: Capacitor ceramic SMD; Preferred: False; SMD_Flag: True; PartCode: CKE 39P/90
C6 C10 = CKE 100N/91: as C24 on sheet MCU; PartCode: CKE 100N/91
C12 = CKE 10P/90: 10pF 50V 5% C0G/NP0; EngPartGrpMainCode: CAP; ManufactpartCode: GRM0335C1H100JA01D-MUR; Type: Capacitor ceramic SMD; Preferred: False; SMD_Flag: True; PartCode: CKE 10P/90
C15 = CKE 68P/70: 68p 5% 25V C0G NP0; EngPartGrpMainCode: CAP; ManufactpartCode: GCM1555C1H680JA16J-MUR; Type: Capacitor ceramic SMD; Preferred: False; SMD_Flag: True; PartCode: CKE 68P/70
C18 = CKE 100P/91: 100pF, 50V, C0G; EngPartGrpMainCode: CAP; ManufactpartCode: GRM0335C1H101GA01D-MUR; Type: Capacitor ceramic SMD; Preferred: False; SMD_Flag: True; PartCode: CKE 100P/91
C20 = CKE 47N/70: 47NF, 50V, 10%; EngPartGrpMainCode: CAP; ManufactpartCode: GCM155R71H473KE02J-MUR; Type: Capacitor ceramic SMD; Preferred: False; SMD_Flag: True; PartCode: CKE 47N/70
C23 C64 C66 C73 = CKE 33P/90: as C27 on sheet MCU; PartCode: CKE 33P/90
C29 C60 C63 = CKE 100N/70: as C17 on sheet MCU; PartCode: CKE 100N/70
C31 = CKE 4U7V10/60: as C19 on sheet MCU; PartCode: CKE 4U7V10/60
C67 = CKE 470NV16/60: 470nF 16V ±10% X5R; EngPartGrpMainCode: CAP; ManufactpartCode: CC0603KRX5R7BB474-YAG; Type: Capacitor ceramic SMD; Preferred: False; SMD_Flag: True; PartCode: CKE 470NV16/60
J1 = CON SMAFS/1: SMA Fem PCB vertical; EngPartGrpMainCode: CONN; ManufactpartCode: 73391-0070-MOL; Preferred: False; PartCode: CON SMAFS/1; Type: Connector HF; SMD_Flag: False
L2 = IND 47N 0A21/70: 47n 2% 210mA; EngPartGrpMainCode: IND; ManufactpartCode: LQW15AN47NG00-MUR; Type: Inductor choke SMD; Preferred: False; SMD_Flag: True; PartCode: IND 47N 0A21/70
L5 = IND 600E 0A3/1: as L3 on sheet MCU; PartCode: IND 600E 0A3/1
L7 = IND 15U 0A12/1: 15uH 120mA; EngPartGrpMainCode: IND; ManufactpartCode: MLZ2012M150WT000-TDK; Type: Inductor choke SMD; Preferred: False; SMD_Flag: True; PartCode: IND 15U 0A12/1
R2 = R 0E/90: 0E 0.05W 1%; PartCode: R 0E/90; EngPartGrpMainCode: RES; ManufactpartCode: CRCW02010000Z0ED-VIS; Preferred: False; SMD_Flag: True; Type: Resistor metalfilm SMD
R3 R4 = R 100E/91: 100E 0.05W 5% 100ppm; EngPartGrpMainCode: RES; ManufactpartCode: CRCW0201100RJNED-VIS; Preferred: False; SMD_Flag: True; PartCode: R 100E/91; Type: Resistor metalfilm SMD
S2 = MEC SHIELD: PCB SMD shield; Manufacturer: Masach Tech; Manufacturer_Part_Number: MS409-10; EngPartGrpMainCode: MEC; ManufactpartCode: 2118718-2-TEC; Preferred: False; SMD_Flag: True; PartCode: MEC SHIELD; Type: Spacer SMD
U2 = IC BGS12WN6: RF-switch; Manufacturer_Part_Number: BGS12SN6; Manufacturer: INFINEON; EngPartGrpMainCode: IC; ManufactpartCode: BGS12WN6E6327XTSA1-INF; Preferred: False; SMD_Flag: True; PartCode: IC BGS12WN6; Type: IC microcontroller SMD
U4 = IC BALFHB-WL-05: Balun; Manufacturer: STMICROELECTRONICS; Manufacturer_Part_Number: IPD STM STM32WL; EngPartGrpMainCode: IC; ManufactpartCode: BALFHB-WL-05D3-STM; Preferred: False; SMD_Flag: True; PartCode: IC BALFHB-WL-05; Type: IC interface SMD
U5 = IC STM32WL55CC: as U5 on sheet MCU; PartCode: IC STM32WL55CC; Type: IC microcontroller SMD

## Sheet Sensor.SchDoc: Titel
size A3; ApprovedBy: name; CompanyName: DCI Electronics bv; DrawnBy: KRS; Address1: Nijverheidsstraat 14; Address2: 4458 AV Eindewege; Address3: Phone: +31 (0)113 344880; DocumentNumber: 11; Revision: 1; SheetNumber: 11; SheetTotal: 14; PageSetup: Record=PageOptions|CenterHorizontal=True|CenterVertical=True|PrintScale=1.00|XCorrection=1.00|YCorrection=1.00|PrintKind=1|BorderSize=5000000|LeftOffset=0|BottomOffset=0|Orientation=2|PaperLength=1000|PaperWidth=1000|Scale=100|PaperSource=7|PrintQuality=-4|MediaType=1|DitherType=10|PaperKind=ISO_A4_(210.00_x_297.00_MM)|PrintScaleMode=1; SubTitle: SubTitel; ApprovedDate: 01-01-12; DesignedBy: HMK
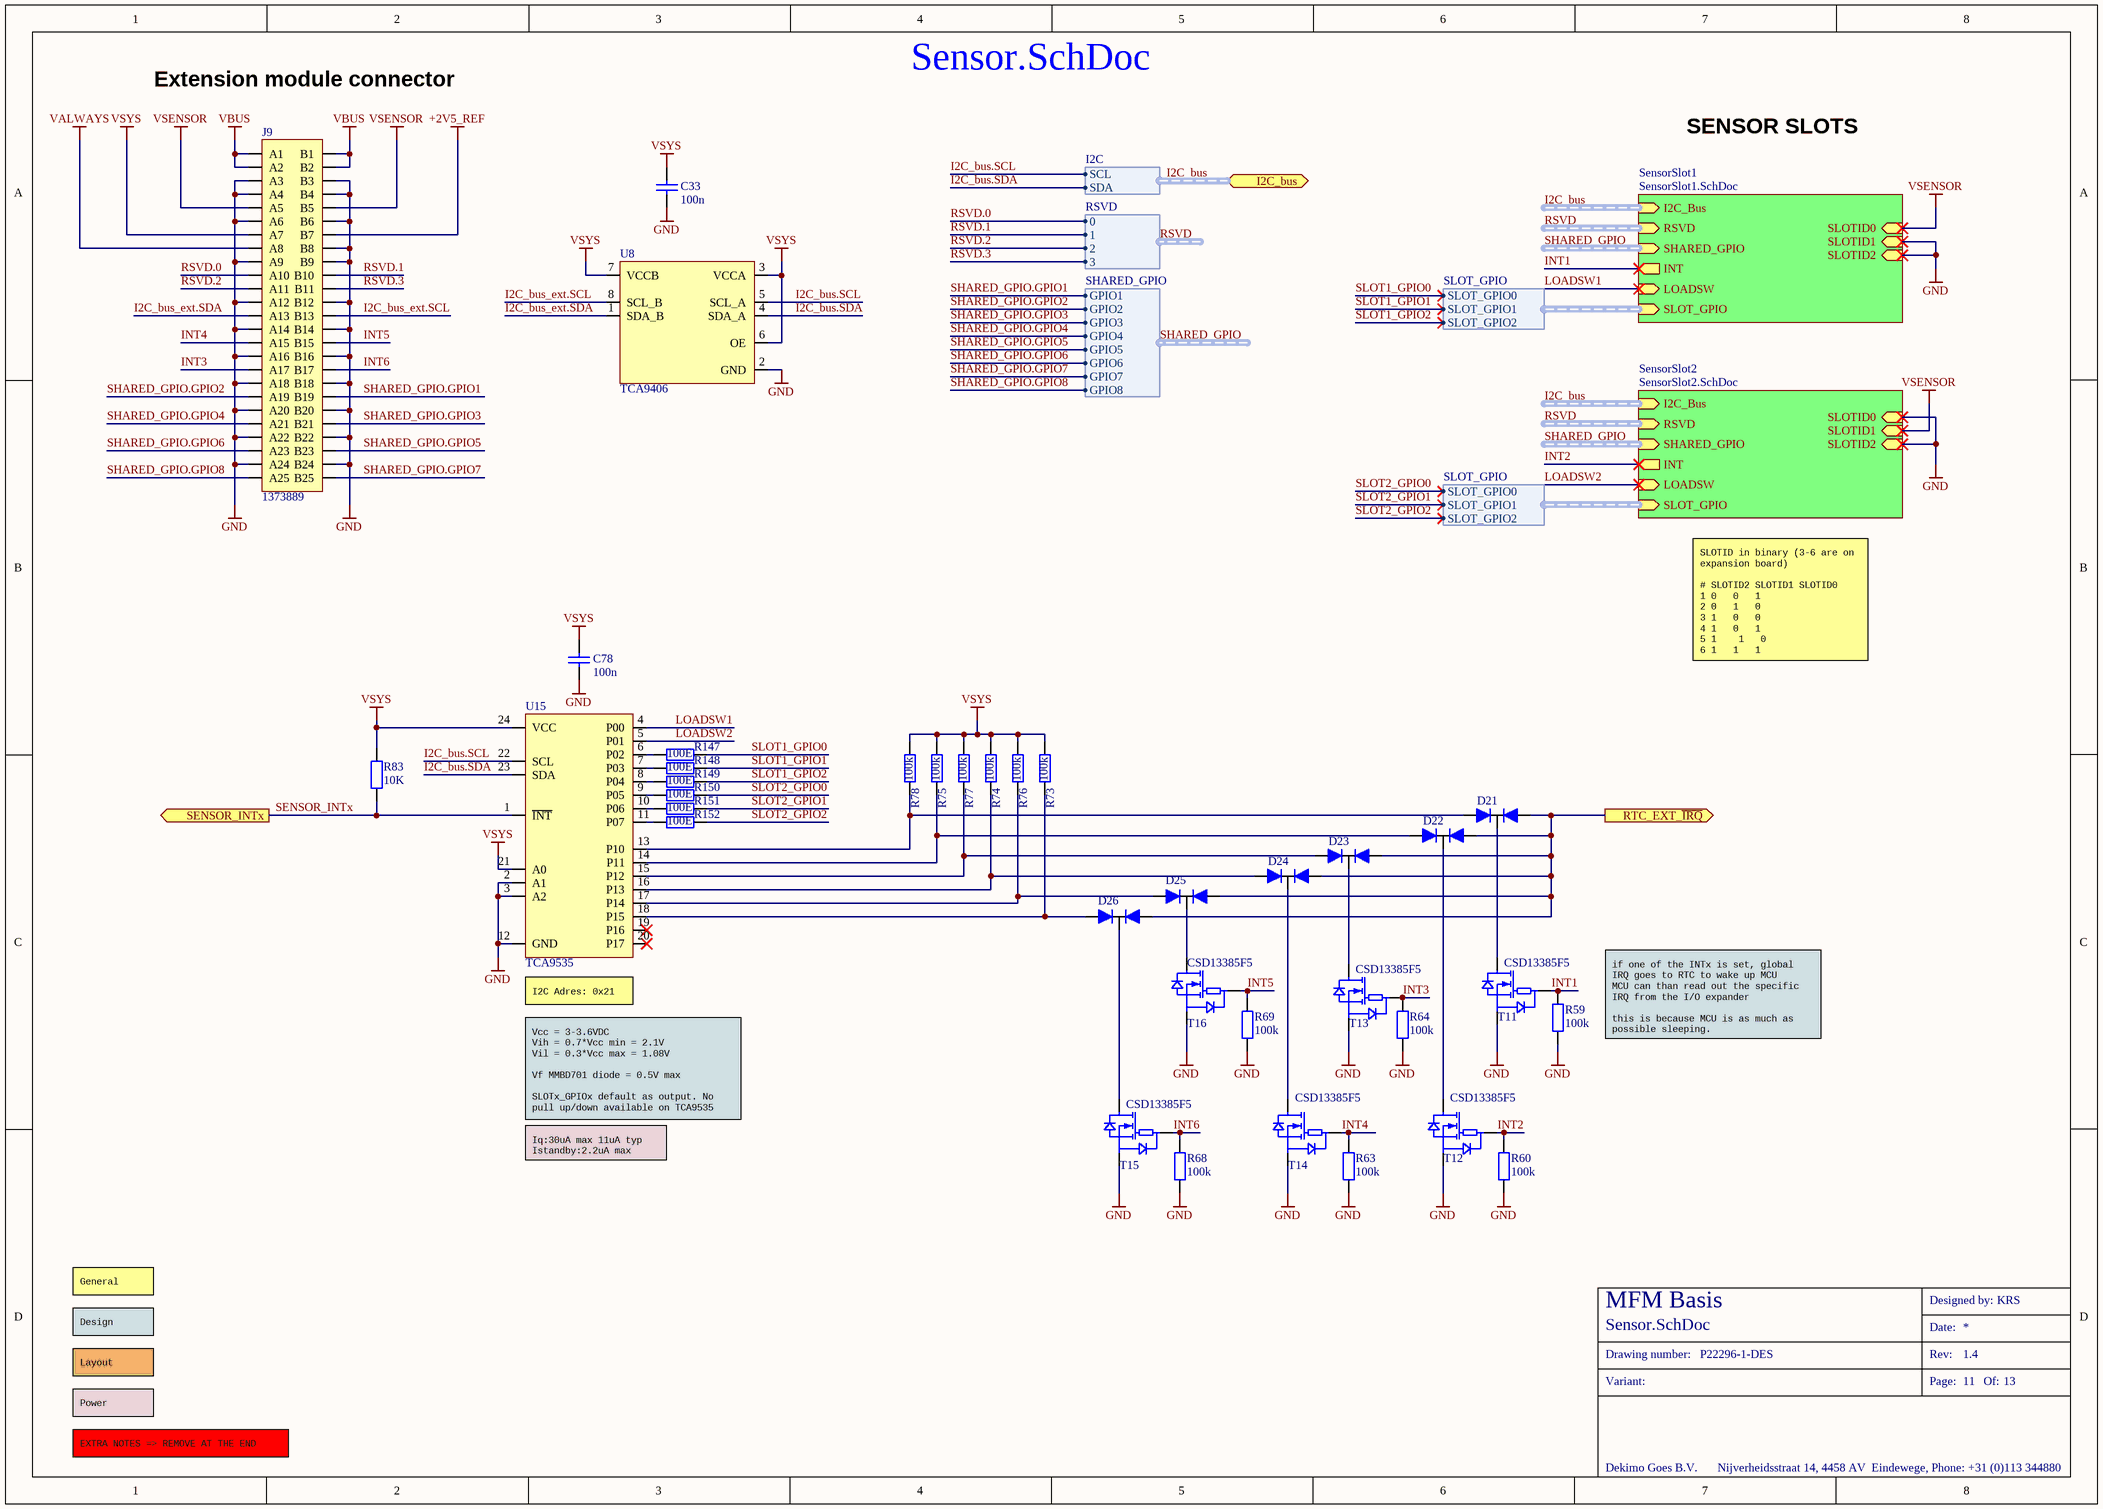
[diagram p4: Sensor.SchDoc]

### Parts
C33  100n  [CAPC1608X09N]
C78  100n  [CAPC1608X09N]
D21  DIO RB508FM-40C  [SOT-650G001-003]  (value not drawn)
D22  DIO RB508FM-40C  [SOT-650G001-003]  (value not drawn)
D23  DIO RB508FM-40C  [SOT-650G001-003]  (value not drawn)
D24  DIO RB508FM-40C  [SOT-650G001-003]  (value not drawn)
D25  DIO RB508FM-40C  [SOT-650G001-003]  (value not drawn)
D26  DIO RB508FM-40C  [SOT-650G001-003]  (value not drawn)
J9  1373889  [CON-111G003-050]
R59  100k  [RESC1005X04N]
R60  100k  [RESC1005X04N]
R63  100k  [RESC1005X04N]
R64  100k  [RESC1005X04N]
R68  100k  [RESC1005X04N]
R69  100k  [RESC1005X04N]
R73  100k  [RESC1005X04N]
R74  100k  [RESC1005X04N]
R75  100k  [RESC1005X04N]
R76  100k  [RESC1005X04N]
R77  100k  [RESC1005X04N]
R78  100k  [RESC1005X04N]
R83  10K  [RESC1608X13N]
R147  100E  [RESC1608X13N]
R148  100E  [RESC1608X13N]
R149  100E  [RESC1608X13N]
R150  100E  [RESC1608X13N]
R151  100E  [RESC1608X13N]
R152  100E  [RESC1608X13N]
T11  CSD13385F5  [DFN-500G000-003]
T12  CSD13385F5  [DFN-500G000-003]
T13  CSD13385F5  [DFN-500G000-003]
T14  CSD13385F5  [DFN-500G000-003]
T15  CSD13385F5  [DFN-500G000-003]
T16  CSD13385F5  [DFN-500G000-003]
U8  TCA9406  [SOP-650002-008]
U15  TCA9535  [SOP-650001-024]

### Sub-sheets
SensorSlot1 = SensorSlot1.SchDoc: I2C_Bus (in, harness I2C), INT (out), SLOT_GPIO (in, harness SLOT_GPIO), LOADSW (in), SLOTID0 (in), SLOTID1 (in), SLOTID2 (in), SHARED_GPIO (in, harness SHARED_GPIO), RSVD (in, harness RSVD)
SensorSlot2 = SensorSlot2.SchDoc: I2C_Bus (in, harness I2C), INT (out), LOADSW (in), SLOT_GPIO (in, harness SLOT_GPIO), SLOTID0 (in), SLOTID1 (in), SLOTID2 (in), SHARED_GPIO (in, harness SHARED_GPIO), RSVD (in, harness RSVD)

### Ports
I2C_bus (bidir, harness I2C), RTC_EXT_~{IRQ} (out), SENSOR_INTx (out)

### Harnesses
RSVD: 0, 1, 2, 3
I2C: SCL, SDA
SLOT_GPIO: SLOT_GPIO0, SLOT_GPIO1, SLOT_GPIO2
SHARED_GPIO: GPIO1, GPIO2, GPIO3, GPIO4, GPIO5, GPIO6, GPIO7, GPIO8

### Nets
+2V5_REF: J9.B7
GND: C33.1 C78.1 J9.A3 J9.A4 J9.A6 J9.A9 J9.A12 J9.A14 J9.A16 J9.A18 J9.A20 J9.A22 J9.A24 J9.B3 J9.B4 J9.B6 J9.B8 J9.B9 J9.B12 J9.B14 J9.B16 J9.B18 J9.B20 J9.B22 J9.B24 R59.1 R60.1 R63.1 R64.1 R68.1 R69.1 T11.S T12.S T13.S T14.S T15.S T16.S U8.2(GND) U15.2(A1) U15.3(A2) U15.12(GND) ; sheet SensorSlot1/SLOTID1, sheet SensorSlot1/SLOTID2, sheet SensorSlot2/SLOTID0, sheet SensorSlot2/SLOTID2
VALWAYS: J9.A8
VBUS: J9.A1 J9.A2 J9.B1 J9.B2
VSENSOR: J9.A5 J9.B5 ; sheet SensorSlot1/SLOTID0, sheet SensorSlot2/SLOTID1
VSYS: C33.2 C78.2 J9.A7 R73.2 R74.2 R75.2 R76.2 R77.2 R78.2 R83.2 U8.3(VCCA) U8.6(OE) U8.7(VCCB) U15.21(A0) U15.24(VCC)
I2C_bus.SCL: U8.5(SCL_A) U15.22(SCL) ; port I2C_bus.SCL
I2C_bus.SDA: U8.4(SDA_A) U15.23(SDA) ; port I2C_bus.SDA
I2C_bus_ext.SCL: J9.B13 U8.8(SCL_B)  [project net I2C_bus_ext.SCL_11]
I2C_bus_ext.SDA: J9.A13 U8.1(SDA_B)  [project net I2C_bus_ext.SDA_11]
INT1: R59.2 T11.G ; sheet SensorSlot1/INT
INT2: R60.2 T12.G ; sheet SensorSlot2/INT
INT3: J9.A17 R64.2 T13.G  [project net INT3_11]
INT4: J9.A15 R63.2 T14.G  [project net INT4_11]
INT5: J9.B15 R69.2 T16.G  [project net INT5_11]
INT6: J9.B17 R68.2 T15.G  [project net INT6_11]
LOADSW1: U15.4(P00) ; sheet SensorSlot1/LOADSW
LOADSW2: U15.5(P01) ; sheet SensorSlot2/LOADSW
RSVD.0: J9.A10 ; sheet SensorSlot1/RSVD.0
RSVD.1: J9.B10 ; sheet SensorSlot1/RSVD.1
RSVD.2: J9.A11 ; sheet SensorSlot1/RSVD.2
RSVD.3: J9.B11 ; sheet SensorSlot1/RSVD.3
RTC_EXT_~{IRQ}: D21.A2 D22.A2 D23.A2 D24.A2 D25.A2 D26.A2 ; port RTC_EXT_~{IRQ}
SENSOR_INTx: R83.1 U15.1(~{INT}) ; port SENSOR_INTx
SHARED_GPIO.GPIO1: J9.B19 ; sheet SensorSlot1/SHARED_GPIO.GPIO1
SHARED_GPIO.GPIO2: J9.A19 ; sheet SensorSlot1/SHARED_GPIO.GPIO2
SHARED_GPIO.GPIO3: J9.B21 ; sheet SensorSlot1/SHARED_GPIO.GPIO3
SHARED_GPIO.GPIO4: J9.A21 ; sheet SensorSlot1/SHARED_GPIO.GPIO4
SHARED_GPIO.GPIO5: J9.B23 ; sheet SensorSlot1/SHARED_GPIO.GPIO5
SHARED_GPIO.GPIO6: J9.A23 ; sheet SensorSlot1/SHARED_GPIO.GPIO6
SHARED_GPIO.GPIO7: J9.B25 ; sheet SensorSlot1/SHARED_GPIO.GPIO7
SHARED_GPIO.GPIO8: J9.A25 ; sheet SensorSlot1/SHARED_GPIO.GPIO8
SLOT1_GPIO0: R147.2 ; sheet SensorSlot1/SLOT_GPIO.SLOT_GPIO0
SLOT1_GPIO1: R148.2 ; sheet SensorSlot1/SLOT_GPIO.SLOT_GPIO1
SLOT1_GPIO2: R149.2 ; sheet SensorSlot1/SLOT_GPIO.SLOT_GPIO2
SLOT2_GPIO0: R150.2 ; sheet SensorSlot2/SLOT_GPIO.SLOT_GPIO0
SLOT2_GPIO1: R151.2 ; sheet SensorSlot2/SLOT_GPIO.SLOT_GPIO1
SLOT2_GPIO2: R152.2 ; sheet SensorSlot2/SLOT_GPIO.SLOT_GPIO2
NetD21_A1: D21.A1 R78.1 U15.13(P10)
NetD21_C: D21.C T11.D
NetD22_A1: D22.A1 R75.1 U15.14(P11)
NetD22_C: D22.C T12.D
NetD23_A1: D23.A1 R77.1 U15.15(P12)
NetD23_C: D23.C T13.D
NetD24_A1: D24.A1 R74.1 U15.16(P13)
NetD24_C: D24.C T14.D
NetD25_A1: D25.A1 R76.1 U15.17(P14)
NetD25_C: D25.C T16.D
NetD26_A1: D26.A1 R73.1 U15.18(P15)
NetD26_C: D26.C T15.D
NetR147_1: R147.1 U15.6(P02)
NetR148_1: R148.1 U15.7(P03)
NetR149_1: R149.1 U15.8(P04)
NetR150_1: R150.1 U15.9(P05)
NetR151_1: R151.1 U15.10(P06)
NetR152_1: R152.1 U15.11(P07)

Not connected (* = marked no-connect by the designer): U15 19(P16)* 20(P17)*

### Buses and harness runs
harness I2C_bus = port I2C_bus
harness I2C_bus = sheet SensorSlot1/I2C_Bus
harness I2C_bus = sheet SensorSlot2/I2C_Bus
harness RSVD = sheet SensorSlot1/RSVD
harness RSVD = sheet SensorSlot2/RSVD
harness SHARED_GPIO = sheet SensorSlot1/SHARED_GPIO
harness SHARED_GPIO = sheet SensorSlot2/SHARED_GPIO

### Notes on the sheet
- Extension module connector
- SENSOR SLOTS
- SLOTID in binary (3-6 are on expansion board)
  # SLOTID2 SLOTID1 SLOTID0
  1 0	  0	  1
  2 0	  1	  0
  3 1	  0	  0
  4 1	  0	  1
  5 1 	  1	  0
  6 1	  1	  1
- (near U15) I2C Adres: 0x21
- if one of the INTx is set, global IRQ goes to RTC to wake up MCU
  MCU can than read out the specific IRQ from the I/O expander
  this is because MCU is as much as possible sleeping.
- Vcc = 3-3.6VDC
  Vih = 0.7*Vcc min = 2.1V
  Vil = 0.3*Vcc max = 1.08V
  Vf MMBD701 diode = 0.5V max
  SLOTx_GPIOx default as output. No pull up/down available on TCA9535
- Iq:30uA max 11uA typ
  Istandby:2.2uA max
- General
- Design
- Layout
- Power
- EXTRA NOTES => REMOVE AT THE END
- Designed by:
- Drawing number:
- Variant:
- Date:
- Page:
- Rev:
- Of:
- Dekimo Goes B.V.
- Nijverheidsstraat 14, 4458 AV  Eindewege, Phone: +31 (0)113 344880

### Library data of the parts
C33 C78 = CKE 100N/60: as C77 on sheet MCU; PartCode: CKE 100N/60
D21-D26 = DIO RB508FM-40C: RB508, 40V, 80mA 2 com cat dio; ManufactpartCode: RB508FM-40CFHT106-RO; Type: Diode SMD; Preferred: False; SMD_Flag: True; PartCode: DIO RB508FM-40C; EngPartGrpMainCode: DIO
J9 = CON BTOB50S/2: 2x25p socket 1.27mm straight; EngPartGrpMainCode: CONN; ManufactpartCode: 651-1373889-PHX; Preferred: False; SMD_Flag: True; PartCode: CON BTOB50S/2; Type: Connector Board to Board SMD
R59 R60 R63 R64 R68 R69 R73-R78 = R 100K/70: as R14 on sheet MCU; PartCode: R 100K/70; Type: Resistor metalfilm SMD
R83 = R 10K/60: as R71 on sheet MCU; PartCode: R 10K/60; Type: Resistor metalfilm SMD; SMD_Flag: True
R147-R152 = R 100E/60: 100E 100mW, 1%; EngPartGrpMainCode: RES; ManufactpartCode: RC0603FR-07100RL-YAG; Preferred: True; PartCode: R 100E/60; Type: Resistor metalfilm SMD; SMD_Flag: True
T11-T16 = TRA CSD13385F5: 7.1A, 12V, N-channel FemtoFet; EngPartGrpMainCode: TRAN; ManufactpartCode: CSD13385F5-TI; Type: FET N-channel SMD; Preferred: False; SMD_Flag: True; PartCode: TRA CSD13385F5
U8 = IC TCA9406: I2C Level translator; EngPartGrpMainCode: IC; ManufactpartCode: TCA9406DCTR-TI; Preferred: False; SMD_Flag: True; PartCode: IC TCA9406; Type: IC driver SMD
U15 = IC TCA9535/SO: as U14 on sheet MCU; PartCode: IC TCA9535/SO; Type: IC Peripheral SMD

## Sheet SensorSlot1.SchDoc: Titel
size A4; ApprovedBy: name; CompanyName: DCI Electronics bv; DrawnBy: KRS; Address1: Nijverheidsstraat 14; Address2: 4458 AV Eindewege; Address3: Phone: +31 (0)113 344880; DocumentNumber: 12; Revision: 1; SheetNumber: 12; SheetTotal: 14; PageSetup: Record=PageOptions|CenterHorizontal=True|CenterVertical=True|PrintScale=1.00|XCorrection=1.00|YCorrection=1.00|PrintKind=1|BorderSize=5000000|LeftOffset=0|BottomOffset=0|Orientation=2|PaperLength=1000|PaperWidth=1000|Scale=100|PaperSource=7|PrintQuality=-4|MediaType=1|DitherType=10|PaperKind=ISO_A4_(210.00_x_297.00_MM)|PrintScaleMode=1; SubTitle: SubTitel; ApprovedDate: 01-01-12; DesignedBy: HMK
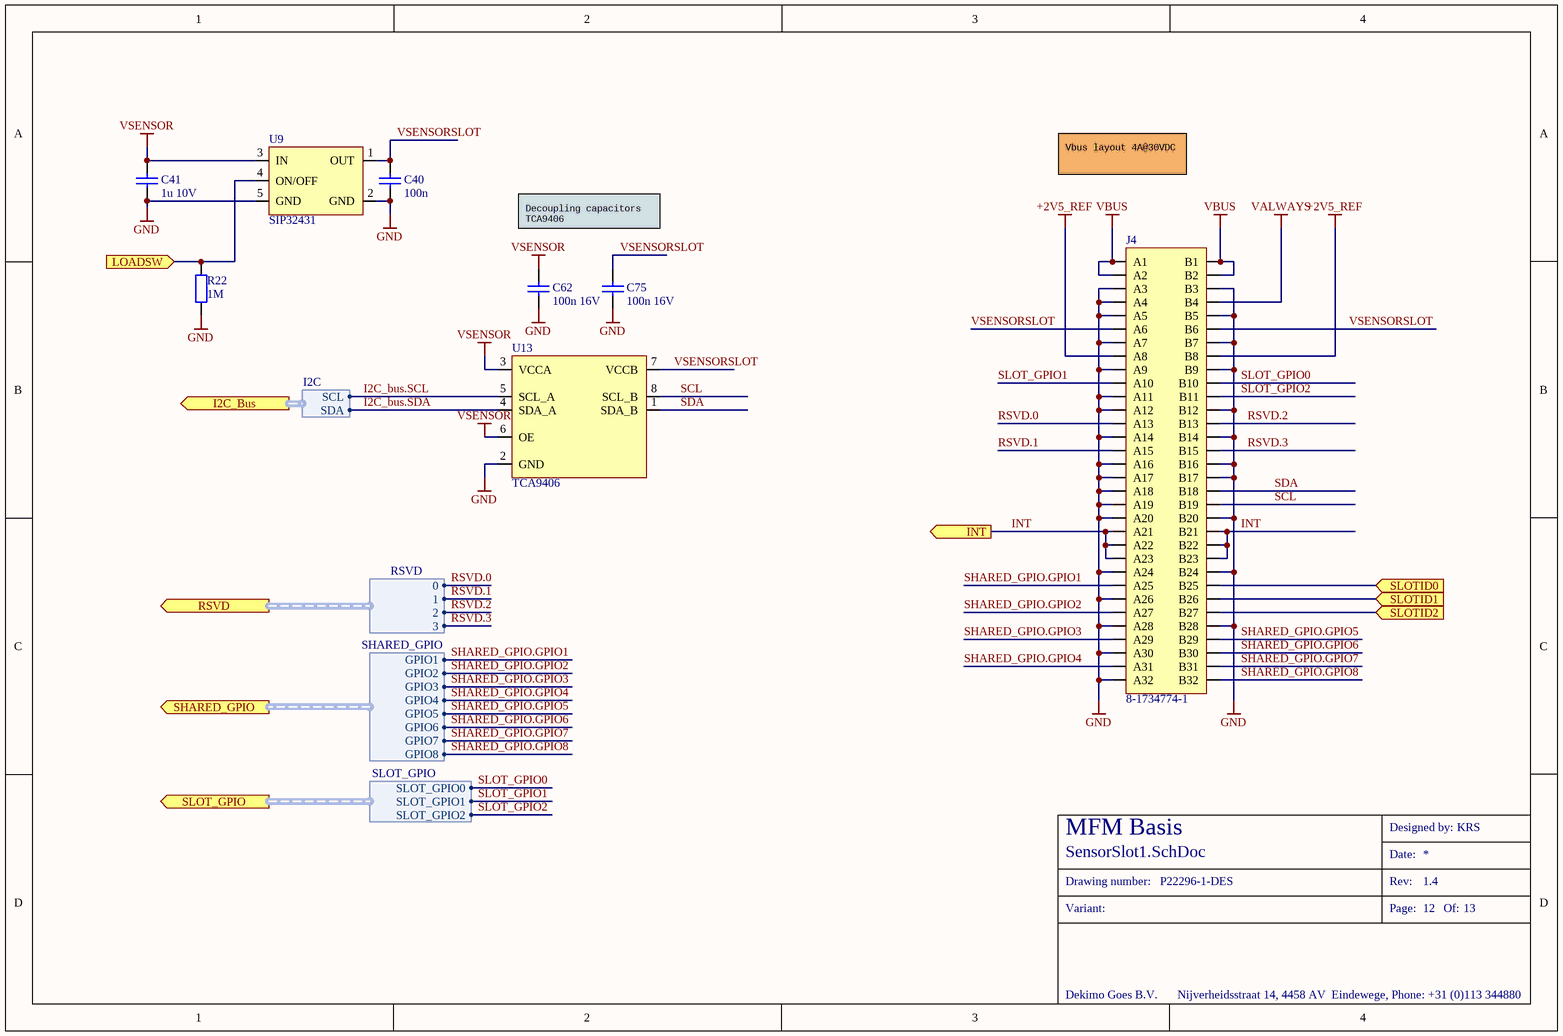
[diagram p5: SensorSlot1.SchDoc]

### Parts
C40  100n  [CAPC1608X09N]
C41  1u 10V  [CAPC1608X09N]
C62  100n 16V  [CAPC1005X05N]
C75  100n 16V  [CAPC1005X05N]
J4  8-1734774-1  [CON-601065-064]
R22  1M  [RESC1005x04N]
U9  SIP32431  [DFN-500001-004]
U13  TCA9406  [SOP-650002-008]

### Ports
I2C_Bus (out, harness I2C), INT (out), LOADSW (in), RSVD (out, harness RSVD), SHARED_GPIO (out, harness SHARED_GPIO), SLOT_GPIO (out, harness SLOT_GPIO), SLOTID0 (in), SLOTID1 (in), SLOTID2 (in)

### Harnesses
I2C: SCL, SDA
SLOT_GPIO: SLOT_GPIO0, SLOT_GPIO1, SLOT_GPIO2
SHARED_GPIO: GPIO1, GPIO2, GPIO3, GPIO4, GPIO5, GPIO6, GPIO7, GPIO8
RSVD: 0, 1, 2, 3

### Nets
+2V5_REF: J4.A8 J4.B8
GND: C40.1 C41.1 C62.1 C75.1 J4.A3 J4.A4 J4.A5 J4.A7 J4.A9 J4.A11 J4.A12 J4.A14 J4.A16 J4.A17 J4.A18 J4.A19 J4.A20 J4.A24 J4.A26 J4.A28 J4.A30 J4.A32 J4.B3 J4.B5 J4.B7 J4.B9 J4.B12 J4.B14 J4.B16 J4.B17 J4.B20 J4.B24 J4.B26 J4.B27 J4.B28 R22.1 U9.2(GND) U9.5(GND) U13.2(GND) ; port SLOTID1, port SLOTID2
VALWAYS: J4.B4
VBUS: J4.A1 J4.A2 J4.B1 J4.B2
VSENSOR: C41.2 C62.2 J4.B25 U9.3(IN) U13.3(VCCA) U13.6(OE) ; port SLOTID0
I2C_bus.SCL: U13.5(SCL_A) ; port I2C_Bus.SCL
I2C_bus.SDA: U13.4(SDA_A) ; port I2C_Bus.SDA
INT: J4.A21 J4.A22 J4.A23 J4.B21 J4.B22 J4.B23 ; port INT  [project net INT1]
LOADSW1: R22.2 U9.4(ON/OFF) ; port LOADSW
RSVD.0: J4.A13 ; port RSVD.0
RSVD.1: J4.A15 ; port RSVD.1
RSVD.2: J4.B13 ; port RSVD.2
RSVD.3: J4.B15 ; port RSVD.3
SCL: J4.B19 U13.8(SCL_B)  [project net SCL_12]
SDA: J4.B18 U13.1(SDA_B)  [project net SDA_12]
SHARED_GPIO.GPIO1: J4.A25 ; port SHARED_GPIO.GPIO1
SHARED_GPIO.GPIO2: J4.A27 ; port SHARED_GPIO.GPIO2
SHARED_GPIO.GPIO3: J4.A29 ; port SHARED_GPIO.GPIO3
SHARED_GPIO.GPIO4: J4.A31 ; port SHARED_GPIO.GPIO4
SHARED_GPIO.GPIO5: J4.B29 ; port SHARED_GPIO.GPIO5
SHARED_GPIO.GPIO6: J4.B30 ; port SHARED_GPIO.GPIO6
SHARED_GPIO.GPIO7: J4.B31 ; port SHARED_GPIO.GPIO7
SHARED_GPIO.GPIO8: J4.B32 ; port SHARED_GPIO.GPIO8
SLOT_GPIO0: J4.B10 ; port SLOT_GPIO.SLOT_GPIO0  [project net SLOT1_GPIO0]
SLOT_GPIO1: J4.A10 ; port SLOT_GPIO.SLOT_GPIO1  [project net SLOT1_GPIO1]
SLOT_GPIO2: J4.B11 ; port SLOT_GPIO.SLOT_GPIO2  [project net SLOT1_GPIO2]
VSENSORSLOT: C40.2 C75.2 J4.A6 J4.B6 U9.1(OUT) U13.7(VCCB)  [project net VSENSORSLOT_12]

### Notes on the sheet
- Vbus layout 4A@30VDC
- Decoupling capacitors
  TCA9406
- Designed by:
- Drawing number:
- Variant:
- Date:
- Page:
- Rev:
- Of:
- Dekimo Goes B.V.
- Nijverheidsstraat 14, 4458 AV  Eindewege, Phone: +31 (0)113 344880

### Library data of the parts
C40 = CKE 100N/60: as C77 on sheet MCU; PartCode: CKE 100N/60
C41 = CKE 1U/60: 1UF, 10V, 10%, 0603, X5R; EngPartGrpMainCode: CAP; ManufactpartCode: 0603ZD105KAT2A-AVX; Type: Capacitor ceramic SMD; Preferred: False; SMD_Flag: True; PartCode: CKE 1U/60
C62 C75 = CKE 100N/70: as C17 on sheet MCU; PartCode: CKE 100N/70
J4 = CON BTOB64S/1: PCIE x4 64pos; EngPartGrpMainCode: CONN; ManufactpartCode: 8-1734774-1-TEC; Preferred: False; PartCode: CON BTOB64S/1; Type: Connector various; SMD_Flag: False
R22 = R 1M/70: as R18 on sheet MCU; Type: Resistor metalfilm SMD
U9 = IC SIP32431DN: load sw, 5.5V, 10pA Ishutdown; EngPartGrpMainCode: IC; ManufactpartCode: SIP32431DNP3-T1GE4-VIS; Preferred: False; SMD_Flag: True; PartCode: IC SIP32431DN; Type: IC switch SMD
U13 = IC TCA9406: as U8 on sheet Sensor; PartCode: IC TCA9406; Type: IC driver SMD

## Sheet SensorSlot2.SchDoc: Titel
size A4; ApprovedBy: name; CompanyName: DCI Electronics bv; DrawnBy: KRS; Address1: Nijverheidsstraat 14; Address2: 4458 AV Eindewege; Address3: Phone: +31 (0)113 344880; DocumentNumber: 13; Revision: 1; SheetNumber: 13; SheetTotal: 14; PageSetup: Record=PageOptions|CenterHorizontal=True|CenterVertical=True|PrintScale=1.00|XCorrection=1.00|YCorrection=1.00|PrintKind=1|BorderSize=5000000|LeftOffset=0|BottomOffset=0|Orientation=2|PaperLength=1000|PaperWidth=1000|Scale=100|PaperSource=7|PrintQuality=-4|MediaType=1|DitherType=10|PaperKind=ISO_A4_(210.00_x_297.00_MM)|PrintScaleMode=1; SubTitle: SubTitel; ApprovedDate: 01-01-12; DesignedBy: HMK
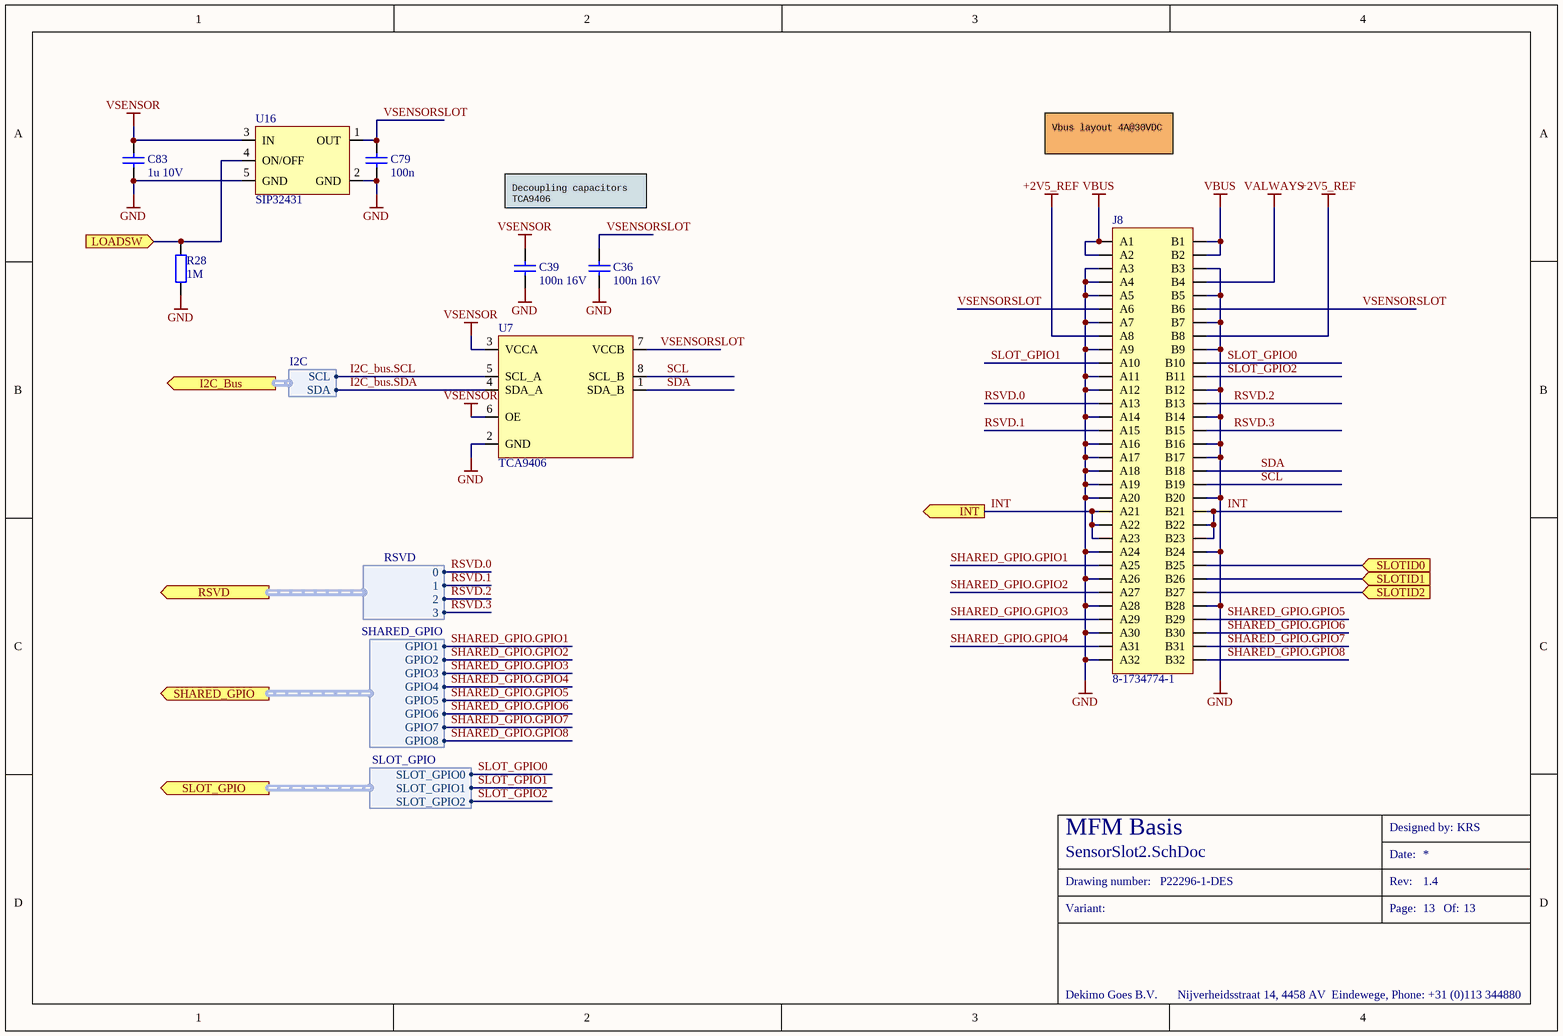
[diagram p6: SensorSlot2.SchDoc]

### Parts
C36  100n 16V  [CAPC1005X05N]
C39  100n 16V  [CAPC1005X05N]
C79  100n  [CAPC1608X09N]
C83  1u 10V  [CAPC1608X09N]
J8  8-1734774-1  [CON-601065-064]
R28  1M  [RESC1005x04N]
U7  TCA9406  [SOP-650002-008]
U16  SIP32431  [DFN-500001-004]

### Ports
I2C_Bus (out, harness I2C), INT (out), LOADSW (in), RSVD (out, harness RSVD), SHARED_GPIO (out, harness SHARED_GPIO), SLOT_GPIO (out, harness SLOT_GPIO), SLOTID0 (in), SLOTID1 (in), SLOTID2 (in)

### Harnesses
SHARED_GPIO: GPIO1, GPIO2, GPIO3, GPIO4, GPIO5, GPIO6, GPIO7, GPIO8
SLOT_GPIO: SLOT_GPIO0, SLOT_GPIO1, SLOT_GPIO2
RSVD: 0, 1, 2, 3
I2C: SCL, SDA

### Nets
+2V5_REF: J8.A8 J8.B8
GND: C36.1 C39.1 C79.1 C83.1 J8.A3 J8.A4 J8.A5 J8.A7 J8.A9 J8.A11 J8.A12 J8.A14 J8.A16 J8.A17 J8.A18 J8.A19 J8.A20 J8.A24 J8.A26 J8.A28 J8.A30 J8.A32 J8.B3 J8.B5 J8.B7 J8.B9 J8.B12 J8.B14 J8.B16 J8.B17 J8.B20 J8.B24 J8.B25 J8.B27 J8.B28 R28.1 U7.2(GND) U16.2(GND) U16.5(GND) ; port SLOTID0, port SLOTID2
VALWAYS: J8.B4
VBUS: J8.A1 J8.A2 J8.B1 J8.B2
VSENSOR: C39.2 C83.2 J8.B26 U7.3(VCCA) U7.6(OE) U16.3(IN) ; port SLOTID1
I2C_bus.SCL: U7.5(SCL_A) ; port I2C_Bus.SCL
I2C_bus.SDA: U7.4(SDA_A) ; port I2C_Bus.SDA
INT: J8.A21 J8.A22 J8.A23 J8.B21 J8.B22 J8.B23 ; port INT  [project net INT2]
LOADSW2: R28.2 U16.4(ON/OFF) ; port LOADSW
RSVD.0: J8.A13 ; port RSVD.0
RSVD.1: J8.A15 ; port RSVD.1
RSVD.2: J8.B13 ; port RSVD.2
RSVD.3: J8.B15 ; port RSVD.3
SCL: J8.B19 U7.8(SCL_B)  [project net SCL_13]
SDA: J8.B18 U7.1(SDA_B)  [project net SDA_13]
SHARED_GPIO.GPIO1: J8.A25 ; port SHARED_GPIO.GPIO1
SHARED_GPIO.GPIO2: J8.A27 ; port SHARED_GPIO.GPIO2
SHARED_GPIO.GPIO3: J8.A29 ; port SHARED_GPIO.GPIO3
SHARED_GPIO.GPIO4: J8.A31 ; port SHARED_GPIO.GPIO4
SHARED_GPIO.GPIO5: J8.B29 ; port SHARED_GPIO.GPIO5
SHARED_GPIO.GPIO6: J8.B30 ; port SHARED_GPIO.GPIO6
SHARED_GPIO.GPIO7: J8.B31 ; port SHARED_GPIO.GPIO7
SHARED_GPIO.GPIO8: J8.B32 ; port SHARED_GPIO.GPIO8
SLOT_GPIO0: J8.B10 ; port SLOT_GPIO.SLOT_GPIO0  [project net SLOT2_GPIO0]
SLOT_GPIO1: J8.A10 ; port SLOT_GPIO.SLOT_GPIO1  [project net SLOT2_GPIO1]
SLOT_GPIO2: J8.B11 ; port SLOT_GPIO.SLOT_GPIO2  [project net SLOT2_GPIO2]
VSENSORSLOT: C36.2 C79.2 J8.A6 J8.B6 U7.7(VCCB) U16.1(OUT)  [project net VSENSORSLOT_13]

### Notes on the sheet
- Vbus layout 4A@30VDC
- Decoupling capacitors
  TCA9406
- Designed by:
- Drawing number:
- Variant:
- Date:
- Page:
- Rev:
- Of:
- Dekimo Goes B.V.
- Nijverheidsstraat 14, 4458 AV  Eindewege, Phone: +31 (0)113 344880

### Library data of the parts
C36 C39 = CKE 100N/70: as C17 on sheet MCU; PartCode: CKE 100N/70
C79 = CKE 100N/60: as C77 on sheet MCU; PartCode: CKE 100N/60
C83 = CKE 1U/60: as C41 on sheet SensorSlot1; PartCode: CKE 1U/60
J8 = CON BTOB64S/1: as J4 on sheet SensorSlot1; PartCode: CON BTOB64S/1; Type: Connector various; SMD_Flag: False
R28 = R 1M/70: as R18 on sheet MCU; Type: Resistor metalfilm SMD
U7 = IC TCA9406: as U8 on sheet Sensor; PartCode: IC TCA9406; Type: IC driver SMD
U16 = IC SIP32431DN: as U9 on sheet SensorSlot1; PartCode: IC SIP32431DN; Type: IC switch SMD